# Altium project 2018_FDP.PrjPcb
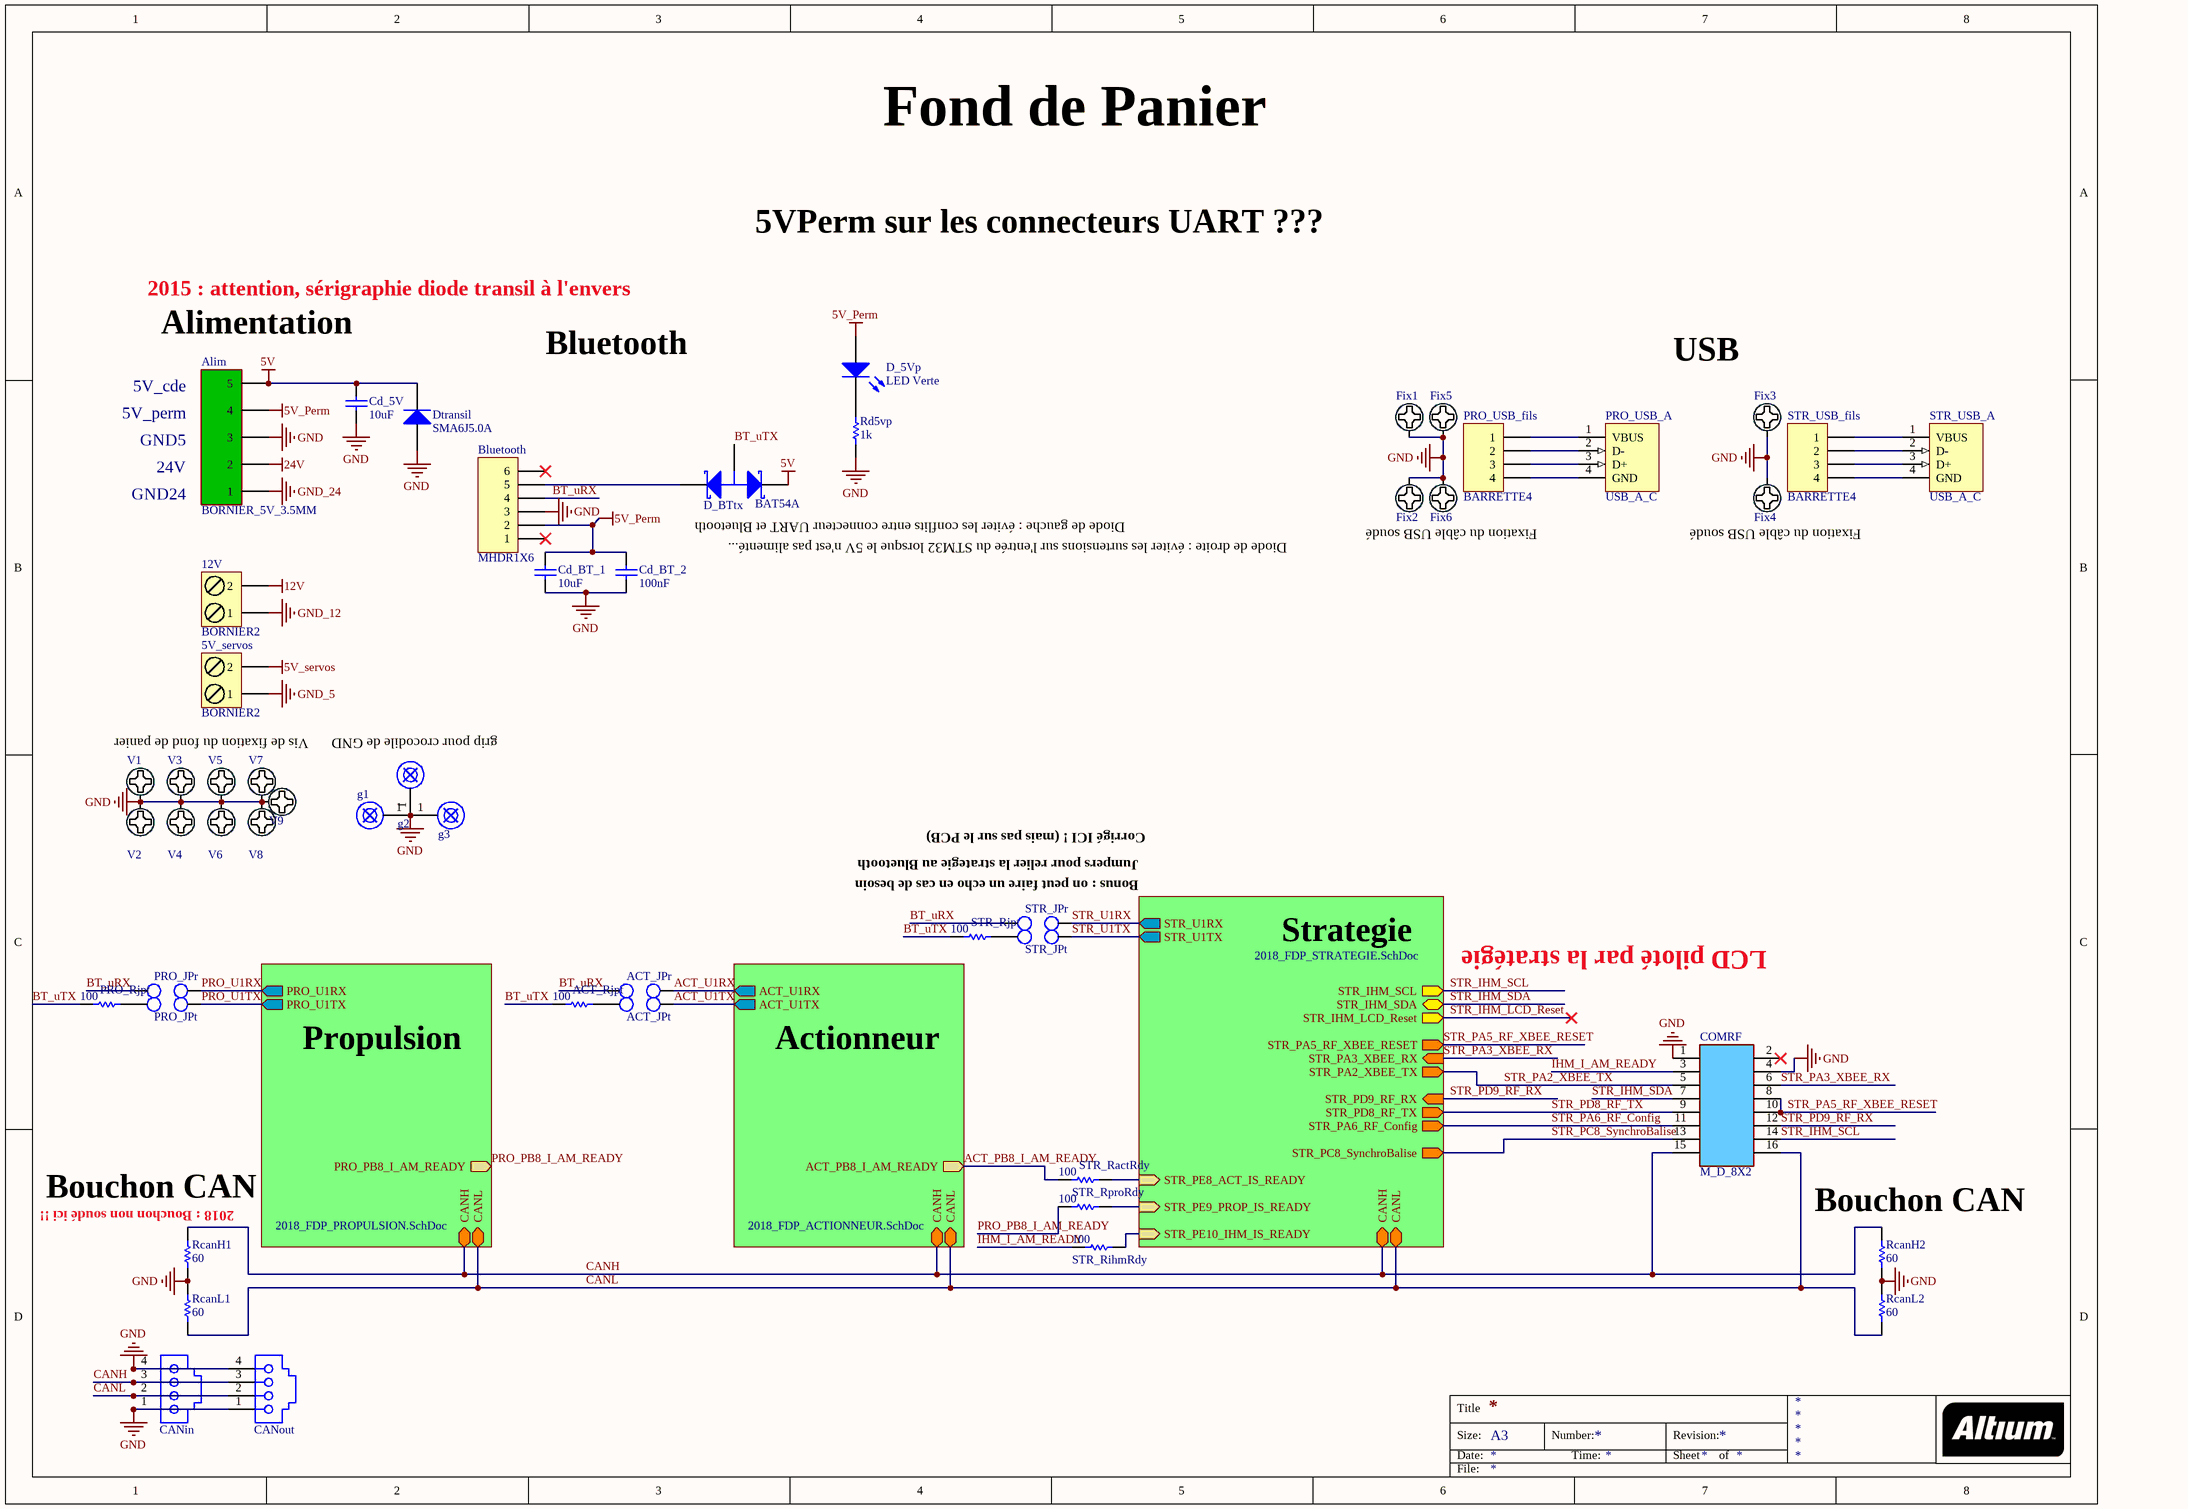
[diagram p0: 2018_FDP_SCHEMA.SchDoc]
3 sheets, 229 parts. Net scope: hierarchical (ports join the sheet entries above them; power ports are global).
Board file: 2018_FDP_PCB.PcbDoc
Sheets:
  2018_FDP_SCHEMA.SchDoc
    Propulsion = 2018_FDP_PROPULSION.SchDoc
    Actionneur = 2018_FDP_ACTIONNEUR.SchDoc

## Sheet 2018_FDP_SCHEMA.SchDoc
size A3

### Parts
5V_servos  BORNIER2  [BORNIER_2V_5.08MM]
12V  BORNIER2  [BORNIER_2V_5.08MM]
ACT_JPr  JUMPER2  [BARRETTE_2_M_D]  (value not drawn)
ACT_JPt  JUMPER2  [BARRETTE_2_M_D]  (value not drawn)
ACT_Rjpt  100  [R1206_N]
Alim  BORNIER_5V_3.5MM  [BORNIER_5V_3.5MM_femelle_0]
Bluetooth  MHDR1X6  [HE14_6]
CANin  634104149621  [634104149621]  (value not drawn)
CANout  634104149621  [634104149621]  (value not drawn)
Cd_5V  10uF  [C1206_N]
Cd_BT_1  10uF  [C1206_N]
Cd_BT_2  100nF  [C0805_N]
COMRF  Type: M_D_8X2  [HE10/16_M_D_B P]  (hidden comment: BARRETTE_8 CONTACTS_2 RANGEES_MALE_DROITE)
D_5Vp  LED Verte  [LED_0805]
D_BTtx  BAT54A  [SOT23-3N]
Dtransil  SMA6J5.0A  [DO214AC]
Fix1  Pad_M3  [Point Test_D3_P1.6mm]  (value not drawn)
Fix2  Pad_M3  [Point Test_D3_P1.6mm]  (value not drawn)
Fix3  Pad_M3  [Point Test_D3_P1.6mm]  (value not drawn)
Fix4  Pad_M3  [Point Test_D3_P1.6mm]  (value not drawn)
Fix5  Pad_M3  [Point Test_D3_P1.6mm]  (value not drawn)
Fix6  Pad_M3  [Point Test_D3_P1.6mm]  (value not drawn)
g1  grip  [POINT_TEST]  (value not drawn)
g2  grip  [POINT_TEST]  (value not drawn)
g3  grip  [POINT_TEST]  (value not drawn)
PRO_JPr  JUMPER2  [BARRETTE_2_M_D]  (value not drawn)
PRO_JPt  JUMPER2  [BARRETTE_2_M_D]  (value not drawn)
PRO_Rjpt  100  [R1206_N]
PRO_USB_A  USB_A_COUDEE  [USB_A_C]  (value not drawn)
PRO_USB_fils  BARRETTE4  [HE14_4]
RcanH1  60  [R1206_N]
RcanH2  60  [R1206_N]
RcanL1  60  [R1206_N]
RcanL2  60  [R1206_N]
Rd5vp  1k  [R1206_N]
STR_JPr  JUMPER2  [BARRETTE_2_M_D]  (value not drawn)
STR_JPt  JUMPER2  [BARRETTE_2_M_D]  (value not drawn)
STR_RactRdy  100  [R1206_N]
STR_RihmRdy  100  [R1206_N]
STR_Rjpt  100  [R1206_N]
STR_RproRdy  100  [R1206_N]
STR_USB_A  USB_A_COUDEE  [USB_A_C]  (value not drawn)
STR_USB_fils  BARRETTE4  [HE14_4]
V1  Pad_M3  [M3x6mm Torx]  (value not drawn)
V2  Pad_M3  [M3x6mm Torx]  (value not drawn)
V3  Pad_M3  [M3x6mm Torx]  (value not drawn)
V4  Pad_M3  [M3x6mm Torx]  (value not drawn)
V5  Pad_M3  [M3x6mm Torx]  (value not drawn)
V6  Pad_M3  [M3x6mm Torx]  (value not drawn)
V7  Pad_M3  [M3x6mm Torx]  (value not drawn)
V8  Pad_M3  [M3x6mm Torx]  (value not drawn)
V9  Pad_M3  [M3x6mm Torx]  (value not drawn)

### Sub-sheets
Actionneur = 2018_FDP_ACTIONNEUR.SchDoc: CANH (bidir), CANL (bidir), ACT_U1RX (out), ACT_U1TX (out), ACT_PB8_I_AM_READY (out)
Propulsion = 2018_FDP_PROPULSION.SchDoc: CANH (bidir), CANL (bidir), PRO_U1RX (out), PRO_U1TX (out), PRO_PB8_I_AM_READY (out)
Strategie = 2018_FDP_STRATEGIE.SchDoc (file not in this document): STR_IHM_SCL (out), STR_IHM_SDA (bidir), STR_IHM_LCD_Reset (out), STR_PA3_XBEE_RX (in), STR_PA2_XBEE_TX (out), STR_PA5_RF_XBEE_RESET (out), STR_PA6_RF_Config (out), STR_PC8_SynchroBalise (out), STR_PD8_RF_TX (out), STR_PD9_RF_RX (in), CANL (bidir), CANH (bidir), STR_U1RX (out), STR_U1TX (out), STR_PE9_PROP_IS_READY (in), STR_PE8_ACT_IS_READY (in), STR_PE10_IHM_IS_READY (in)

### Nets
5V: Alim.5 Cd_5V.2 D_BTtx.2(K2) Dtransil.2(K)
5V_Perm: Alim.4 Bluetooth.2 Cd_BT_1.2 Cd_BT_2.2 D_5Vp.1(A)
5V_servos: 5V_servos.2
12V: 12V.2
24V: Alim.2
GND: Alim.3 Bluetooth.3 CANin.1 CANin.4 CANout.1 CANout.4 Cd_5V.1 Cd_BT_1.1 Cd_BT_2.1 COMRF.1 COMRF.4 Dtransil.1(A) Fix1.1 Fix2.1 Fix3.1 Fix4.1 Fix5.1 Fix6.1 g1.1 g2.1 g3.1 RcanH1.1 RcanH2.2 RcanL1.2 RcanL2.2 Rd5vp.2 V1.1 V2.1 V3.1 V4.1 V5.1 V6.1 V7.1 V8.1 V9.1
GND_5: 5V_servos.1
GND_12: 12V.1
GND_24: Alim.1
ACT_PB8_I_AM_READY: STR_RactRdy.2 ; sheet Actionneur/ACT_PB8_I_AM_READY
ACT_U1RX: ACT_JPr.2 ; sheet Actionneur/ACT_U1RX
ACT_U1TX: ACT_JPt.2 ; sheet Actionneur/ACT_U1TX
BT_uRX: ACT_JPr.1 Bluetooth.4 PRO_JPr.1 STR_JPr.1
BT_uTX: ACT_Rjpt.2 D_BTtx.3(A) PRO_Rjpt.2 STR_Rjpt.2
CANH: CANin.3 CANout.3 COMRF.15 RcanH1.2 RcanH2.1 ; sheet Propulsion/CANH, sheet Strategie/CANH, sheet Actionneur/CANH
CANL: CANin.2 CANout.2 COMRF.16 RcanL1.1 RcanL2.1 ; sheet Propulsion/CANL, sheet Strategie/CANL, sheet Actionneur/CANL
IHM_I_AM_READY: COMRF.3 STR_RihmRdy.2
PRO_PB8_I_AM_READY: STR_RproRdy.2 ; sheet Propulsion/PRO_PB8_I_AM_READY
PRO_U1RX: PRO_JPr.2 ; sheet Propulsion/PRO_U1RX
PRO_U1TX: PRO_JPt.2 ; sheet Propulsion/PRO_U1TX
STR_IHM_LCD_Reset: sheet Strategie/STR_IHM_LCD_Reset
STR_IHM_SCL: COMRF.14 ; sheet Strategie/STR_IHM_SCL
STR_IHM_SDA: COMRF.7 ; sheet Strategie/STR_IHM_SDA
STR_PA2_XBEE_TX: COMRF.5 ; sheet Strategie/STR_PA2_XBEE_TX
STR_PA3_XBEE_RX: COMRF.6 ; sheet Strategie/STR_PA3_XBEE_RX
STR_PA5_RF_XBEE_RESET: COMRF.8 COMRF.10 ; sheet Strategie/STR_PA5_RF_XBEE_RESET
STR_PA6_RF_Config: COMRF.11 ; sheet Strategie/STR_PA6_RF_Config
STR_PC8_SynchroBalise: COMRF.13 ; sheet Strategie/STR_PC8_SynchroBalise
STR_PD8_RF_TX: COMRF.9 ; sheet Strategie/STR_PD8_RF_TX
STR_PD9_RF_RX: COMRF.12 ; sheet Strategie/STR_PD9_RF_RX
STR_U1RX: STR_JPr.2 ; sheet Strategie/STR_U1RX
STR_U1TX: STR_JPt.2 ; sheet Strategie/STR_U1TX
NetACT_JPt_1: ACT_JPt.1 ACT_Rjpt.1
NetBluetooth_5: Bluetooth.5 D_BTtx.1(K1)
NetD_5Vp_2: D_5Vp.2(K) Rd5vp.1
NetPRO_JPt_1: PRO_JPt.1 PRO_Rjpt.1
NetPRO_USB_A_1: PRO_USB_A.1(VBUS) PRO_USB_fils.1
NetPRO_USB_A_2: PRO_USB_A.2(D-) PRO_USB_fils.2
NetPRO_USB_A_3: PRO_USB_A.3(D+) PRO_USB_fils.3
NetPRO_USB_A_4: PRO_USB_A.4(GND) PRO_USB_fils.4
NetSTR_JPt_1: STR_JPt.1 STR_Rjpt.1
NetSTR_RactRdy_1: STR_RactRdy.1 ; sheet Strategie/STR_PE8_ACT_IS_READY
NetSTR_RihmRdy_1: STR_RihmRdy.1 ; sheet Strategie/STR_PE10_IHM_IS_READY
NetSTR_RproRdy_1: STR_RproRdy.1 ; sheet Strategie/STR_PE9_PROP_IS_READY
NetSTR_USB_A_1: STR_USB_A.1(VBUS) STR_USB_fils.1
NetSTR_USB_A_2: STR_USB_A.2(D-) STR_USB_fils.2
NetSTR_USB_A_3: STR_USB_A.3(D+) STR_USB_fils.3
NetSTR_USB_A_4: STR_USB_A.4(GND) STR_USB_fils.4

Not connected (* = marked no-connect by the designer): Bluetooth 1* 6*; COMRF 2*

### Notes on the sheet
- Fond de Panier
- 5VPerm sur les connecteurs UART ???
- 2015 : attention, sérigraphie diode transil à l'envers
- Alimentation
- Bluetooth
- USB
- 5V_perm
- 5V_cde
- GND5
- 24V
- GND24
- Diode de gauche : éviter les conflits entre connecteur UART et Bluetooth
- (near Cd_BT_2) Diode de droite : éviter les surtensions sur l'entrée du STM32 lorsque le 5V n'est pas alimenté...
- Fixation du câble USB soudé
- Vis de fixation du fond de panier
- (near g2) grip pour crocodile de GND
- Jumpers pour relier la strategie au Bluetooth
- Corrigé ICI ! (mais pas sur le PCB)
- Bonus : on peut faire un echo en cas de besoin
- LCD piloté par la stratégie
- (near RcanH1) Bouchon CAN
- (near RcanH1) 2018 : Bouchon non soudé ici !!
- (near RcanH2) Bouchon CAN
- Title
- Size:
- Date:
- A3
- Number:
- Time:
- Revision:
- Sheet
- of
- File:

### Library data of the parts
5V_servos 12V = BORNIER2: Terminal blocks, 2 pins, pitch=5mm
ACT_JPr ACT_JPt PRO_JPr PRO_JPt STR_JPr STR_JPt = JUMPER2: BARRETTE 2 CONTACTS 1 RANGEE MALE DROITE; Type: JUMPER2
ACT_Rjpt PRO_Rjpt RcanH1 RcanH2 RcanL1 RcanL2 Rd5vp STR_RactRdy STR_RihmRdy STR_Rjpt STR_RproRdy = Resistor: Published: 8-Jun-2000; LatestRevisionDate: 17-Jul-2002; LatestRevisionNote: Re-released for DXP Platform.; PackageReference: AXIAL-0.5; Publisher: Altium Limited
Bluetooth = MHDR1X6: Header, 6-Pin; LatestRevisionDate: 17-Jul-2002; LatestRevisionNote: Re-released for DXP Platform.; Publisher: Altium Limited
CANin CANout = 634104149621: Modular Jack SMT Vertical Plastic 4P4C Top Entry WR-MJ; Rated Current: 1.5 A; Working Voltage: 120 VAC; Withstanding Voltage: 1000 VAC; Port: 1x1; ComponentLink1Description: Manufacturer; ComponentLink1URL: http://www.we-online.de; ComponentLink2Description: Datasheet; ComponentLink2URL: http://katalog.we-online.com/em/datasheet/634104149621.pdf; Part Number: 634104149621; Published Date: September 2017; Publisher: Wurth Elektronik; Pin Number: 4P4C; Entrance: Vertical
Cd_5V Cd_BT_1 Cd_BT_2 = Condensateur: Capacitor; Published: 8-Jun-2000; LatestRevisionDate: 17-Jul-2002; LatestRevisionNote: Re-released for DXP Platform.; PackageReference: RAD-0.3; Publisher: Altium Limited
D_5Vp = LED: Typical LED; Published: 8-Jun-2000; LatestRevisionDate: 08-Jul-2005; LatestRevisionNote: Mech Layer 1 removed.; PackageReference: LED-1; Publisher: Altium Limited
D_BTtx = Diode Shottky double  BAT54A: DIODE SCHOTTKY DOUBLE; Manufacturer: ZETEX; ComponentLink1URL: http://www.farnell.com/datasheets/27632.pdf; ComponentLink1Description: http://www.farnell.com/datasheets/27632.pdf; Supplier Part Number: 9526498; Supplier: Farnell; RoHS: YES; Manufacturer Part Number: BAT54A
Dtransil = Diode 1N4001: 1 Amp General Purpose Rectifier; Published: 8-Jun-2000; LatestRevisionDate: 17-Jul-2002; LatestRevisionNote: Re-released for DXP Platform.; DatasheetVersion: 1998; PackageVersion: Aug-1999; PackageReference: DO-41; Publisher: Altium Limited; Code_JEDEC: DO-204-AL; ComponentLink1Description: Manufacturer Link; ComponentLink1URL: http://www.fairchildsemi.com/; ComponentLink2Description: Datasheet; ComponentLink2URL: http://www.fairchildsemi.com/ds/1N%2F1N4001.pdf
Fix1-Fix6 V1-V9 = Vis M3 X 6mm _TORX_Tête 6mm: Publisher: Damien Guitton
g1-g3 = POINT_TEST: POINT TEST
PRO_USB_A STR_USB_A = USB_A_COUDEE: EMBASE USB TRAVERSANTE TYPE A COUDEE; Type: USB_A_C
PRO_USB_fils STR_USB_fils = BARRETTE4: Header, 4-Pin; LatestRevisionDate: 17-Jul-2002; LatestRevisionNote: Re-released for DXP Platform.; Publisher: Altium Limited

## Sheet 2018_FDP_PROPULSION.SchDoc
size A2
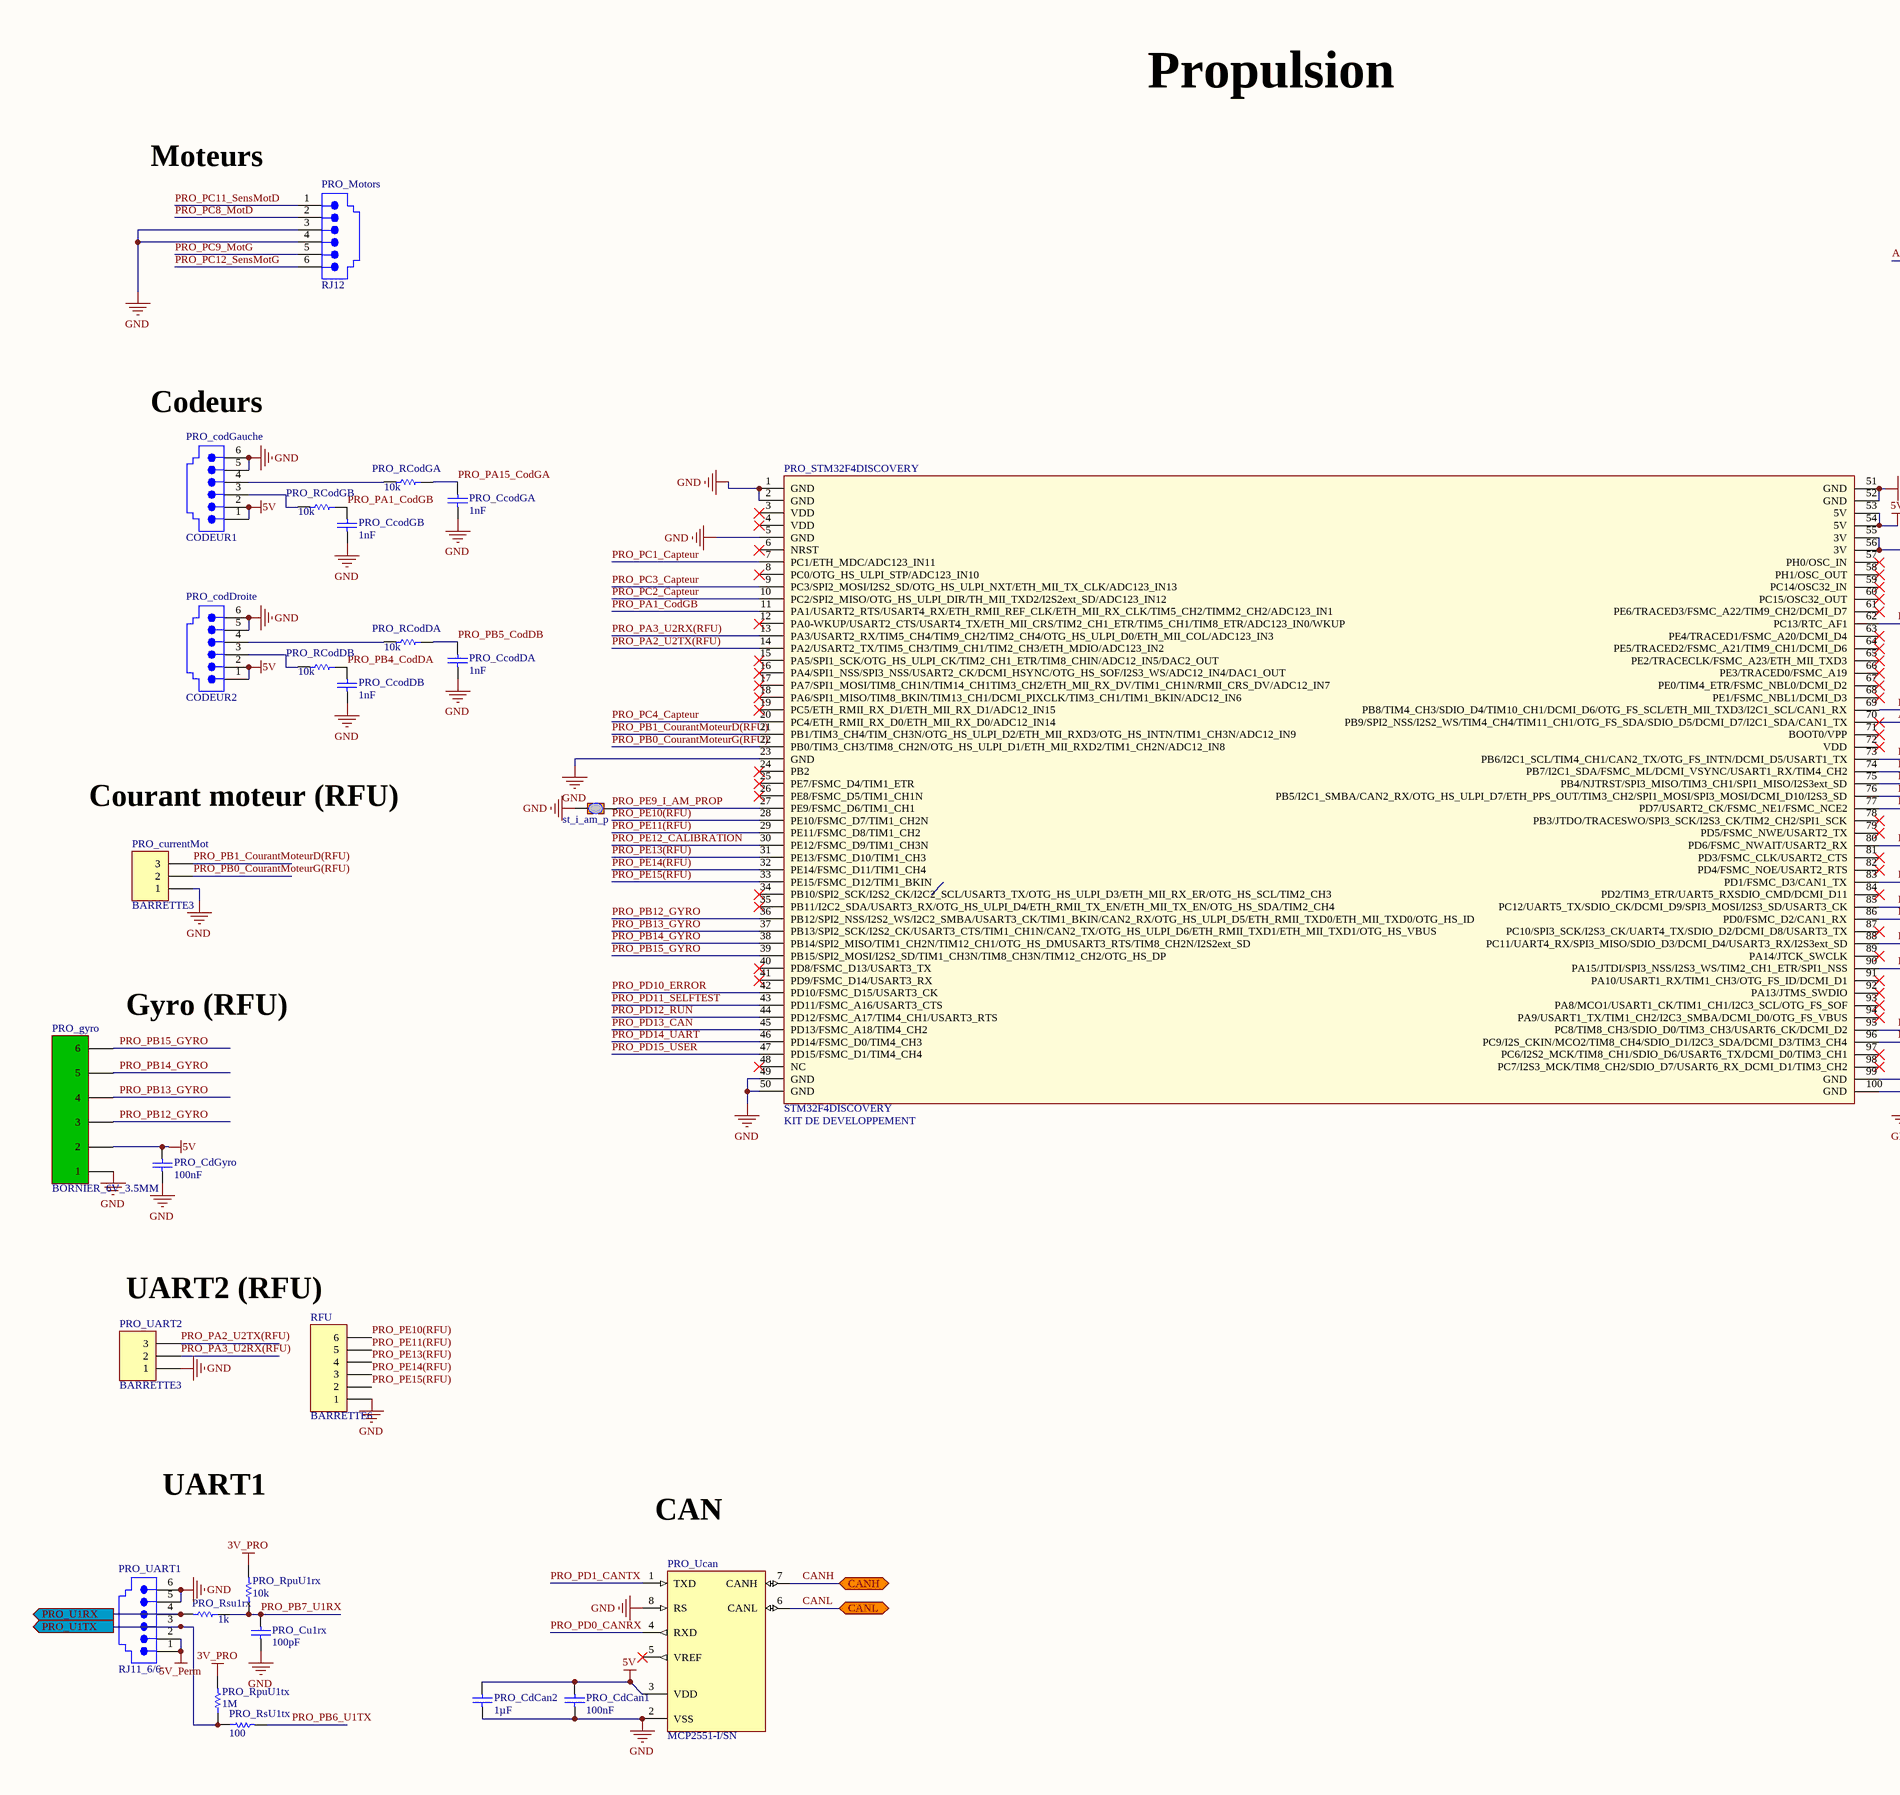
[diagram p1: 2018_FDP_PROPULSION.SchDoc, left]
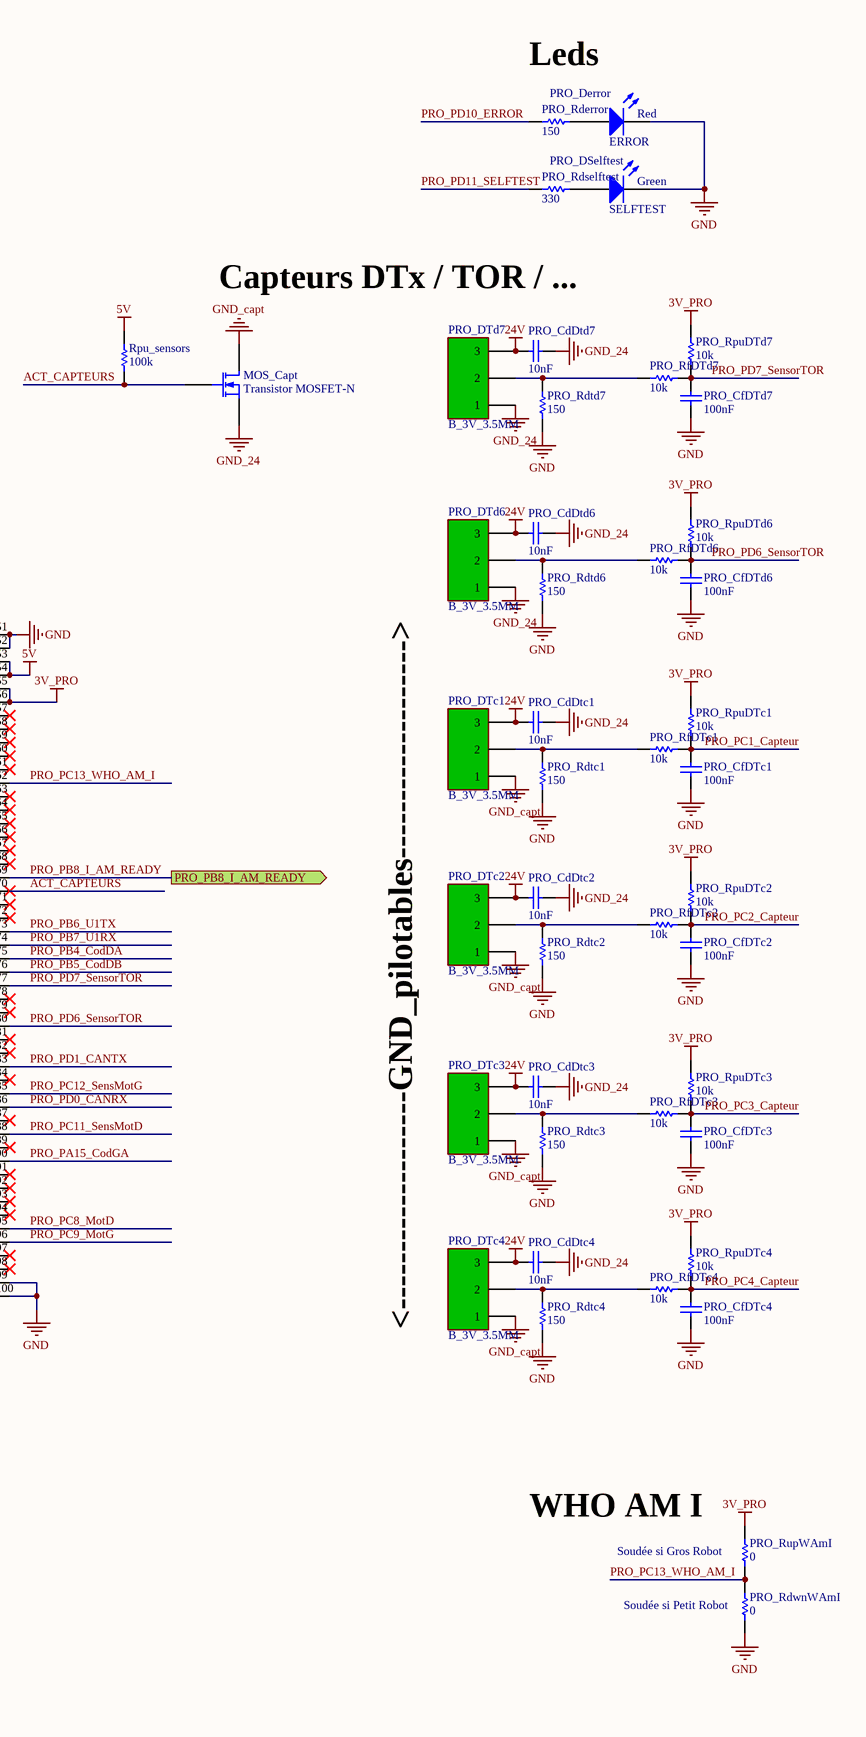
[diagram p2: 2018_FDP_PROPULSION.SchDoc, right]

### Parts
MOS_Capt  Transistor MOSFET-N  [SOT23-3N]
PRO_CcodDA  1nF  [C0805_N]
PRO_CcodDB  1nF  [C0805_N]
PRO_CcodGA  1nF  [C0805_N]
PRO_CcodGB  1nF  [C0805_N]
PRO_CdCan1  100nF  [C0805_N]
PRO_CdCan2  1µF  [C0805_N]
PRO_CdDtc1  10nF  [C0805_N]
PRO_CdDtc2  10nF  [C0805_N]
PRO_CdDtc3  10nF  [C0805_N]
PRO_CdDtc4  10nF  [C0805_N]
PRO_CdDtd6  10nF  [C0805_N]
PRO_CdDtd7  10nF  [C0805_N]
PRO_CdGyro  100nF  [C0805_N]
PRO_CfDTc1  100nF  [C0805_N]
PRO_CfDTc2  100nF  [C0805_N]
PRO_CfDTc3  100nF  [C0805_N]
PRO_CfDTc4  100nF  [C0805_N]
PRO_CfDTd6  100nF  [C0805_N]
PRO_CfDTd7  100nF  [C0805_N]
PRO_codDroite  CODEUR2  [RJ11_6/6 - droit]
PRO_codGauche  CODEUR1  [RJ11_6/6 - droit]
PRO_Cu1rx  100pF  [C0805_N]
PRO_currentMot  BARRETTE3  [HE14_3]
PRO_Derror  ERROR  [LED_0805]
PRO_DSelftest  SELFTEST  [LED_0805]
PRO_DTc1  B_3V_3.5MM  [BORNIER_3V_3.5MM]
PRO_DTc2  B_3V_3.5MM  [BORNIER_3V_3.5MM]
PRO_DTc3  B_3V_3.5MM  [BORNIER_3V_3.5MM]
PRO_DTc4  B_3V_3.5MM  [BORNIER_3V_3.5MM]
PRO_DTd6  B_3V_3.5MM  [BORNIER_3V_3.5MM]
PRO_DTd7  B_3V_3.5MM  [BORNIER_3V_3.5MM]
PRO_gyro  BORNIER_6V_3.5MM  [BORNIER_6V_3.5MM]
PRO_Motors  RJ12  [RJ11_6/6 - droit]
PRO_RCodDA  10k  [R1206_N]
PRO_RCodDB  10k  [R1206_N]
PRO_RCodGA  10k  [R1206_N]
PRO_RCodGB  10k  [R1206_N]
PRO_Rderror  150  [R1206_N]
PRO_Rdselftest  330  [R1206_N]
PRO_Rdtc1  150  [R1206_N]
PRO_Rdtc2  150  [R1206_N]
PRO_Rdtc3  150  [R1206_N]
PRO_Rdtc4  150  [R1206_N]
PRO_Rdtd6  150  [R1206_N]
PRO_Rdtd7  150  [R1206_N]
PRO_RdwnWAmI  0  [R1206_N]
PRO_RfDTc1  10k  [R1206_N]
PRO_RfDTc2  10k  [R1206_N]
PRO_RfDTc3  10k  [R1206_N]
PRO_RfDTc4  10k  [R1206_N]
PRO_RfDTd6  10k  [R1206_N]
PRO_RfDTd7  10k  [R1206_N]
PRO_RpuDTc1  10k  [R1206_N]
PRO_RpuDTc2  10k  [R1206_N]
PRO_RpuDTc3  10k  [R1206_N]
PRO_RpuDTc4  10k  [R1206_N]
PRO_RpuDTd6  10k  [R1206_N]
PRO_RpuDTd7  10k  [R1206_N]
PRO_RpuU1rx  10k  [R1206_N]
PRO_RpuU1tx  1M  [R1206_N]
PRO_Rsu1rx  1k  [R1206_N]
PRO_RsU1tx  100  [R1206_N]
PRO_RupWAmI  0  [R1206_N]
PRO_STM32F4DISCOVERY  STM32F4DISCOVERY  Type: KIT DE DEVELOPPEMENT  [STM32_F4DISCOVERY]
PRO_UART1  RJ11_6/6  [RJ11_6/6 - droit]
PRO_UART2  BARRETTE3  [HE14_3]
PRO_Ucan  MCP2551-I/SN  [SO8_N]
RFU  BARRETTE6  [HE14_6]
Rpu_sensors  100k  [R1206_N]
st_i_am_p  Goutte Strap_2  [Goutte Strap_2 Pads_Clearance 0.254mm]  (value not drawn)

### Ports
CANH (bidir), CANL (bidir), PRO_PB8_I_AM_READY (out), PRO_U1RX (out), PRO_U1TX (out)

### Nets
3V_PRO: PRO_RpuDTc1.2 PRO_RpuDTc2.2 PRO_RpuDTc3.2 PRO_RpuDTc4.2 PRO_RpuDTd6.2 PRO_RpuDTd7.2 PRO_RpuU1rx.2 PRO_RpuU1tx.2 PRO_RupWAmI.2 PRO_STM32F4DISCOVERY.55(3V) PRO_STM32F4DISCOVERY.56(3V)
5V: PRO_CdCan1.2 PRO_CdCan2.2 PRO_CdGyro.2 PRO_codDroite.1 PRO_codDroite.2 PRO_codGauche.1 PRO_codGauche.2 PRO_gyro.2 PRO_STM32F4DISCOVERY.53(5V) PRO_STM32F4DISCOVERY.54(5V) PRO_Ucan.3(VDD) Rpu_sensors.2
5V_Perm: PRO_UART1.1 PRO_UART1.2
24V: PRO_CdDtc1.2 PRO_CdDtc2.2 PRO_CdDtc3.2 PRO_CdDtc4.2 PRO_CdDtd6.2 PRO_CdDtd7.2 PRO_DTc1.3 PRO_DTc2.3 PRO_DTc3.3 PRO_DTc4.3 PRO_DTd6.3 PRO_DTd7.3
GND: PRO_CcodDA.1 PRO_CcodDB.1 PRO_CcodGA.1 PRO_CcodGB.1 PRO_CdCan1.1 PRO_CdCan2.1 PRO_CdGyro.1 PRO_CfDTc1.1 PRO_CfDTc2.1 PRO_CfDTc3.1 PRO_CfDTc4.1 PRO_CfDTd6.1 PRO_CfDTd7.1 PRO_codDroite.5 PRO_codDroite.6 PRO_codGauche.5 PRO_codGauche.6 PRO_Cu1rx.1 PRO_currentMot.1 PRO_Derror.2(K) PRO_DSelftest.2(K) PRO_gyro.1 PRO_Motors.3 PRO_Motors.4 PRO_Rdtc1.1 PRO_Rdtc2.1 PRO_Rdtc3.1 PRO_Rdtc4.1 PRO_Rdtd6.1 PRO_Rdtd7.1 PRO_RdwnWAmI.1 PRO_STM32F4DISCOVERY.1(GND) PRO_STM32F4DISCOVERY.2(GND) PRO_STM32F4DISCOVERY.5(GND) PRO_STM32F4DISCOVERY.23(GND) PRO_STM32F4DISCOVERY.49(GND) PRO_STM32F4DISCOVERY.50(GND) PRO_STM32F4DISCOVERY.51(GND) PRO_STM32F4DISCOVERY.52(GND) PRO_STM32F4DISCOVERY.99(GND) PRO_STM32F4DISCOVERY.100(GND) PRO_UART1.5 PRO_UART1.6 PRO_UART2.1 PRO_Ucan.2(VSS) PRO_Ucan.8(RS) RFU.1 st_i_am_p.1
GND_24: MOS_Capt.2(S) PRO_CdDtc1.1 PRO_CdDtc2.1 PRO_CdDtc3.1 PRO_CdDtc4.1 PRO_CdDtd6.1 PRO_CdDtd7.1 PRO_DTd6.1 PRO_DTd7.1
GND_capt: MOS_Capt.3(D) PRO_DTc1.1 PRO_DTc2.1 PRO_DTc3.1 PRO_DTc4.1
ACT_CAPTEURS: MOS_Capt.1(G) PRO_STM32F4DISCOVERY.70(PB9/SPI2_NSS/I2S2_WS/TIM4_CH4/TIM11_CH1/OTG_FS_SDA/SDIO_D5/DCMI_D7/I2C1_SDA/CAN1_TX) Rpu_sensors.1
CANH: PRO_Ucan.7(CANH) ; port CANH
CANL: PRO_Ucan.6(CANL) ; port CANL
PRO_PA1_CodGB: PRO_CcodGB.2 PRO_RCodGB.1 PRO_STM32F4DISCOVERY.11(PA1/USART2_RTS/USART4_RX/ETH_RMII_REF_CLK/ETH_MII_RX_CLK/TIM5_CH2/TIMM2_CH2/ADC123_IN1)
PRO_PA2_U2TX(RFU): PRO_STM32F4DISCOVERY.14(PA2/USART2_TX/TIM5_CH3/TIM9_CH1/TIM2_CH3/ETH_MDIO/ADC123_IN2) PRO_UART2.3
PRO_PA3_U2RX(RFU): PRO_STM32F4DISCOVERY.13(PA3/USART2_RX/TIM5_CH4/TIM9_CH2/TIM2_CH4/OTG_HS_ULPI_D0/ETH_MII_COL/ADC123_IN3) PRO_UART2.2
PRO_PA15_CodGA: PRO_CcodGA.2 PRO_RCodGA.1 PRO_STM32F4DISCOVERY.90(PA15/JTDI/SPI3_NSS/I2S3_WS/TIM2_CH1_ETR/SPI1_NSS)
PRO_PB0_CourantMoteurG(RFU): PRO_currentMot.2 PRO_STM32F4DISCOVERY.22(PB0/TIM3_CH3/TIM8_CH2N/OTG_HS_ULPI_D1/ETH_MII_RXD2/TIM1_CH2N/ADC12_IN8)
PRO_PB1_CourantMoteurD(RFU): PRO_currentMot.3 PRO_STM32F4DISCOVERY.21(PB1/TIM3_CH4/TIM_CH3N/OTG_HS_ULPI_D2/ETH_MII_RXD3/OTG_HS_INTN/TIM1_CH3N/ADC12_IN9)
PRO_PB4_CodDA: PRO_CcodDB.2 PRO_RCodDB.1 PRO_STM32F4DISCOVERY.75(PB4/NJTRST/SPI3_MISO/TIM3_CH1/SPI1_MISO/I2S3ext_SD)
PRO_PB5_CodDB: PRO_CcodDA.2 PRO_RCodDA.1 PRO_STM32F4DISCOVERY.76(PB5/I2C1_SMBA/CAN2_RX/OTG_HS_ULPI_D7/ETH_PPS_OUT/TIM3_CH2/SPI1_MOSI/SPI3_MOSI/DCMI_D10/I2S3_SD)
PRO_PB6_U1TX: PRO_RsU1tx.2 PRO_STM32F4DISCOVERY.73(PB6/I2C1_SCL/TIM4_CH1/CAN2_TX/OTG_FS_INTN/DCMI_D5/USART1_TX)
PRO_PB7_U1RX: PRO_Cu1rx.2 PRO_RpuU1rx.1 PRO_Rsu1rx.1 PRO_STM32F4DISCOVERY.74(PB7/I2C1_SDA/FSMC_ML/DCMI_VSYNC/USART1_RX/TIM4_CH2)
PRO_PB8_I_AM_READY: PRO_STM32F4DISCOVERY.69(PB8/TIM4_CH3/SDIO_D4/TIM10_CH1/DCMI_D6/OTG_FS_SCL/ETH_MII_TXD3/I2C1_SCL/CAN1_RX) ; port PRO_PB8_I_AM_READY
PRO_PB12_GYRO: PRO_gyro.3 PRO_STM32F4DISCOVERY.36(PB12/SPI2_NSS/I2S2_WS/I2C2_SMBA/USART3_CK/TIM1_BKIN/CAN2_RX/OTG_HS_ULPI_D5/ETH_RMII_TXD0/ETH_MII_TXD0/OTG_HS_ID)
PRO_PB13_GYRO: PRO_gyro.4 PRO_STM32F4DISCOVERY.37(PB13/SPI2_SCK/I2S2_CK/USART3_CTS/TIM1_CH1N/CAN2_TX/OTG_HS_ULPI_D6/ETH_RMII_TXD1/ETH_MII_TXD1/OTG_HS_VBUS)
PRO_PB14_GYRO: PRO_gyro.5 PRO_STM32F4DISCOVERY.38(PB14/SPI2_MISO/TIM1_CH2N/TIM12_CH1/OTG_HS_DMUSART3_RTS/TIM8_CH2N/I2S2ext_SD)
PRO_PB15_GYRO: PRO_gyro.6 PRO_STM32F4DISCOVERY.39(PB15/SPI2_MOSI/I2S2_SD/TIM1_CH3N/TIM8_CH3N/TIM12_CH2/OTG_HS_DP)
PRO_PC1_Capteur: PRO_CfDTc1.2 PRO_RfDTc1.2 PRO_RpuDTc1.1 PRO_STM32F4DISCOVERY.7(PC1/ETH_MDC/ADC123_IN11)
PRO_PC2_Capteur: PRO_CfDTc2.2 PRO_RfDTc2.2 PRO_RpuDTc2.1 PRO_STM32F4DISCOVERY.10(PC2/SPI2_MISO/OTG_HS_ULPI_DIR/TH_MII_TXD2/I2S2ext_SD/ADC123_IN12)
PRO_PC3_Capteur: PRO_CfDTc3.2 PRO_RfDTc3.2 PRO_RpuDTc3.1 PRO_STM32F4DISCOVERY.9(PC3/SPI2_MOSI/I2S2_SD/OTG_HS_ULPI_NXT/ETH_MII_TX_CLK/ADC123_IN13)
PRO_PC4_Capteur: PRO_CfDTc4.2 PRO_RfDTc4.2 PRO_RpuDTc4.1 PRO_STM32F4DISCOVERY.20(PC4/ETH_RMII_RX_D0/ETH_MII_RX_D0/ADC12_IN14)
PRO_PC8_MotD: PRO_Motors.2 PRO_STM32F4DISCOVERY.95(PC8/TIM8_CH3/SDIO_D0/TIM3_CH3/USART6_CK/DCMI_D2)
PRO_PC9_MotG: PRO_Motors.5 PRO_STM32F4DISCOVERY.96(PC9/I2S_CKIN/MCO2/TIM8_CH4/SDIO_D1/I2C3_SDA/DCMI_D3/TIM3_CH4)
PRO_PC11_SensMotD: PRO_Motors.1 PRO_STM32F4DISCOVERY.88(PC11/UART4_RX/SPI3_MISO/SDIO_D3/DCMI_D4/USART3_RX/I2S3ext_SD)
PRO_PC12_SensMotG: PRO_Motors.6 PRO_STM32F4DISCOVERY.85(PC12/UART5_TX/SDIO_CK/DCMI_D9/SPI3_MOSI/I2S3_SD/USART3_CK)
PRO_PC13_WHO_AM_I: PRO_RdwnWAmI.2 PRO_RupWAmI.1 PRO_STM32F4DISCOVERY.62(PC13/RTC_AF1)
PRO_PD0_CANRX: PRO_STM32F4DISCOVERY.86(PD0/FSMC_D2/CAN1_RX) PRO_Ucan.4(RXD)
PRO_PD1_CANTX: PRO_STM32F4DISCOVERY.83(PD1/FSMC_D3/CAN1_TX) PRO_Ucan.1(TXD)
PRO_PD6_SensorTOR: PRO_CfDTd6.2 PRO_RfDTd6.2 PRO_RpuDTd6.1 PRO_STM32F4DISCOVERY.80(PD6/FSMC_NWAIT/USART2_RX)
PRO_PD7_SensorTOR: PRO_CfDTd7.2 PRO_RfDTd7.2 PRO_RpuDTd7.1 PRO_STM32F4DISCOVERY.77(PD7/USART2_CK/FSMC_NE1/FSMC_NCE2)
PRO_PD10_ERROR: PRO_Rderror.1 PRO_STM32F4DISCOVERY.42(PD10/FSMC_D15/USART3_CK)
PRO_PD11_SELFTEST: PRO_Rdselftest.1 PRO_STM32F4DISCOVERY.43(PD11/FSMC_A16/USART3_CTS)
PRO_PD12_RUN: PRO_STM32F4DISCOVERY.44(PD12/FSMC_A17/TIM4_CH1/USART3_RTS)
PRO_PD13_CAN: PRO_STM32F4DISCOVERY.45(PD13/FSMC_A18/TIM4_CH2)
PRO_PD14_UART: PRO_STM32F4DISCOVERY.46(PD14/FSMC_D0/TIM4_CH3)
PRO_PD15_USER: PRO_STM32F4DISCOVERY.47(PD15/FSMC_D1/TIM4_CH4)
PRO_PE10(RFU): PRO_STM32F4DISCOVERY.28(PE10/FSMC_D7/TIM1_CH2N) RFU.6
PRO_PE11(RFU): PRO_STM32F4DISCOVERY.29(PE11/FSMC_D8/TIM1_CH2) RFU.5
PRO_PE12_CALIBRATION: PRO_STM32F4DISCOVERY.30(PE12/FSMC_D9/TIM1_CH3N)
PRO_PE13(RFU): PRO_STM32F4DISCOVERY.31(PE13/FSMC_D10/TIM1_CH3) RFU.4
PRO_PE14(RFU): PRO_STM32F4DISCOVERY.32(PE14/FSMC_D11/TIM1_CH4) RFU.3
PRO_PE15(RFU): PRO_STM32F4DISCOVERY.33(PE15/FSMC_D12/TIM1_BKIN) RFU.2
PRO_U1RX: PRO_Rsu1rx.2 PRO_UART1.4 ; port PRO_U1RX
PRO_U1TX: PRO_RpuU1tx.1 PRO_RsU1tx.1 PRO_UART1.3 ; port PRO_U1TX
NetPRO_codDroite_3: PRO_codDroite.3 PRO_RCodDB.2
NetPRO_codDroite_4: PRO_codDroite.4 PRO_RCodDA.2
NetPRO_codGauche_3: PRO_codGauche.3 PRO_RCodGB.2
NetPRO_codGauche_4: PRO_codGauche.4 PRO_RCodGA.2
NetPRO_Derror_1: PRO_Derror.1(A) PRO_Rderror.2
NetPRO_DSelftest_1: PRO_DSelftest.1(A) PRO_Rdselftest.2
NetPRO_DTc1_2: PRO_DTc1.2 PRO_Rdtc1.2 PRO_RfDTc1.1
NetPRO_DTc2_2: PRO_DTc2.2 PRO_Rdtc2.2 PRO_RfDTc2.1
NetPRO_DTc3_2: PRO_DTc3.2 PRO_Rdtc3.2 PRO_RfDTc3.1
NetPRO_DTc4_2: PRO_DTc4.2 PRO_Rdtc4.2 PRO_RfDTc4.1
NetPRO_DTd6_2: PRO_DTd6.2 PRO_Rdtd6.2 PRO_RfDTd6.1
NetPRO_DTd7_2: PRO_DTd7.2 PRO_Rdtd7.2 PRO_RfDTd7.1
NetPRO_STM32F4DISCOVERY_27: PRO_STM32F4DISCOVERY.27(PE9/FSMC_D6/TIM1_CH1) st_i_am_p.2

Not connected (* = marked no-connect by the designer): PRO_STM32F4DISCOVERY 3(VDD)* 4(VDD)* 6(NRST)* 8(PC0/OTG_HS_ULPI_STP/ADC123_IN10)* 12(PA0-WKUP/USART2_CTS/USART4_TX/ETH_MII_CRS/TIM2_CH1_ETR/TIM5_CH1/TIM8_ETR/ADC123_IN0/WKUP)* 15(PA5/SPI1_SCK/OTG_HS_ULPI_CK/TIM2_CH1_ETR/TIM8_CHIN/ADC12_IN5/DAC2_OUT)* 16(PA4/SPI1_NSS/SPI3_NSS/USART2_CK/DCMI_HSYNC/OTG_HS_SOF/I2S3_WS/ADC12_IN4/DAC1_OUT)* 17(PA7/SPI1_MOSI/TIM8_CH1N/TIM14_CH1TIM3_CH2/ETH_MII_RX_DV/TIM1_CH1N/RMII_CRS_DV/ADC12_IN7)* 18(PA6/SPI1_MISO/TIM8_BKIN/TIM13_CH1/DCMI_PIXCLK/TIM3_CH1/TIM1_BKIN/ADC12_IN6)* 19(PC5/ETH_RMII_RX_D1/ETH_MII_RX_D1/ADC12_IN15)* 24(PB2)* 25(PE7/FSMC_D4/TIM1_ETR)* 26(PE8/FSMC_D5/TIM1_CH1N)* 34(PB10/SPI2_SCK/I2S2_CK/I2C2_SCL/USART3_TX/OTG_HS_ULPI_D3/ETH_MII_RX_ER/OTG_HS_SCL/TIM2_CH3)* 35(PB11/I2C2_SDA/USART3_RX/OTG_HS_ULPI_D4/ETH_RMII_TX_EN/ETH_MII_TX_EN/OTG_HS_SDA/TIM2_CH4)* 40(PD8/FSMC_D13/USART3_TX)* 41(PD9/FSMC_D14/USART3_RX)* 48(NC)* 57(PH0/OSC_IN)* 58(PH1/OSC_OUT)* 59(PC14/OSC32_IN)* 60(PC15/OSC32_OUT)* 61(PE6/TRACED3/FSMC_A22/TIM9_CH2/DCMI_D7)* 63(PE4/TRACED1/FSMC_A20/DCMI_D4)* 64(PE5/TRACED2/FSMC_A21/TIM9_CH1/DCMI_D6)* 65(PE2/TRACECLK/FSMC_A23/ETH_MII_TXD3)* 66(PE3/TRACED0/FSMC_A19)* 67(PE0/TIM4_ETR/FSMC_NBL0/DCMI_D2)* 68(PE1/FSMC_NBL1/DCMI_D3)* 71(BOOT0/VPP)* 72(VDD)* 78(PB3/JTDO/TRACESWO/SPI3_SCK/I2S3_CK/TIM2_CH2/SPI1_SCK)* 79(PD5/FSMC_NWE/USART2_TX)* 81(PD3/FSMC_CLK/USART2_CTS)* 82(PD4/FSMC_NOE/USART2_RTS)* 84(PD2/TIM3_ETR/UART5_RXSDIO_CMD/DCMI_D11)* 87(PC10/SPI3_SCK/I2S3_CK/UART4_TX/SDIO_D2/DCMI_D8/USART3_TX)* 89(PA14/JTCK_SWCLK)* 91(PA10/USART1_RX/TIM1_CH3/OTG_FS_ID/DCMI_D1)* 92(PA13/JTMS_SWDIO)* 93(PA8/MCO1/USART1_CK/TIM1_CH1/I2C3_SCL/OTG_FS_SOF)* 94(PA9/USART1_TX/TIM1_CH2/I2C3_SMBA/DCMI_D0/OTG_FS_VBUS)* 97(PC6/I2S2_MCK/TIM8_CH1/SDIO_D6/USART6_TX/DCMI_D0/TIM3_CH1)* 98(PC7/I2S3_MCK/TIM8_CH2/SDIO_D7/USART6_RX_DCMI_D1/TIM3_CH2)*; PRO_Ucan 5(VREF)*

### Notes on the sheet
- Leds
- (near PRO_Derror) Red
- Propulsion
- (near PRO_DSelftest) Green
- Moteurs
- Capteurs DTx / TOR / ...
- (near PRO_codGauche) Codeurs
- Courant moteur (RFU)
- (near PRO_gyro) Gyro (RFU)
- <-------------------GND_pilotables------------------->
- (near PRO_UART2) UART2 (RFU)
- WHO AM I
- (near PRO_RupWAmI) Soudée si Gros Robot
- (near PRO_RdwnWAmI) Soudée si Petit Robot
- UART1
- CAN
- Labels drawn without touching a wire or pin: PRO_PE9_I_AM_PROP
- Title
- Size:
- Date:
- File:
- A2
- Number:
- Time:
- Revision:
- Sheet
- of

### Library data of the parts
MOS_Capt = Transistor MOSFET-N: N-Channel MOSFET; PackageDocument: 1995/1996; Published: 8-Jun-2000; LatestRevisionDate: 17-Jul-2002; LatestRevisionNote: Re-released for DXP Platform.; PackageReference: E3; Publisher: Altium Limited
PRO_CcodDA PRO_CcodDB PRO_CcodGA PRO_CcodGB PRO_CdCan1 PRO_CdCan2 PRO_CdDtc1-PRO_CdDtc4 PRO_CdDtd6 PRO_CdDtd7 PRO_CdGyro PRO_CfDTc1-PRO_CfDTc4 PRO_CfDTd6 PRO_CfDTd7 PRO_Cu1rx = Condensateur: Capacitor; Published: 8-Jun-2000; LatestRevisionDate: 17-Jul-2002; LatestRevisionNote: Re-released for DXP Platform.; PackageReference: RAD-0.3; Publisher: Altium Limited
PRO_codDroite PRO_codGauche PRO_Motors PRO_UART1 = RJ11_6/6: Right Angle, Standard Profile, Offset Latch DECconnect, Flangeless PCB Jack; Ports: 1; Positions/Loaded: Port1 - 6 Offset Latch/6; PerformanceCategory: 3; PCB_Mounting: Thru-Hole; DrillSize: Nominal, Rounded to nearest 0.05mm; PCB_Layout: Complies with Manufacturer's Recommendation.; Published: 25-Jun-2002; DatasheetDocument: 18-Dec-2001; PackageDocument: 18-Dec-2001; PackageReference: 15-43-6110; Publisher: Altium Limited; ComponentLink1Description: Manufacturer Link; ComponentLink1URL: http://www.molex.com/; ComponentLink2Description: Datasheet; ComponentLink2URL: http://www.molex.com/cmc_upload/common_files/1212003_41369catalogpage.pdf
  PRO_Motors PRO_UART1: Type: RJ11_6/6
PRO_currentMot PRO_UART2 = BARRETTE3: Header, 3-Pin; LatestRevisionDate: 17-Jul-2002; LatestRevisionNote: Re-released for DXP Platform.; Publisher: Altium Limited
PRO_Derror PRO_DSelftest = LED: Typical LED; Published: 8-Jun-2000; LatestRevisionDate: 08-Jul-2005; LatestRevisionNote: Mech Layer 1 removed.; PackageReference: LED-1; Publisher: Altium Limited
PRO_DTc1-PRO_DTc4 PRO_DTd6 PRO_DTd7 = BORNIER_3V_3.5MM
PRO_RCodDA PRO_RCodDB PRO_RCodGA PRO_RCodGB PRO_Rderror PRO_Rdselftest PRO_Rdtc1-PRO_Rdtc4 PRO_Rdtd6 PRO_Rdtd7 PRO_RdwnWAmI PRO_RfDTc1-PRO_RfDTc4 PRO_RfDTd6 PRO_RfDTd7 PRO_RpuDTc1-PRO_RpuDTc4 PRO_RpuDTd6 PRO_RpuDTd7 PRO_RpuU1rx PRO_RpuU1tx PRO_Rsu1rx PRO_RsU1tx PRO_RupWAmI Rpu_sensors = Resistor: Published: 8-Jun-2000; LatestRevisionDate: 17-Jul-2002; LatestRevisionNote: Re-released for DXP Platform.; PackageReference: AXIAL-0.5; Publisher: Altium Limited
PRO_STM32F4DISCOVERY = STM32F4DISCOVERY: KIT DE DEVELOPPEMENT POUR MICROCONTROLEUR STM32F407VGT6
PRO_Ucan = MCP2551-I/SN: High-Speed CAN Transceiver, 8-Pin SOIC, Industrial Temperature; Published: 25/11/09; DatasheetVersion: revE, Jan-2007; PackageVersion: revAW, Oct-2008; PackageReference: SOIC-SN8; Publisher: Damien Guitton; PackageDescription: 8-Lead Plastic Small Outline (SN) - Narrow, 3.90mm Body [SOIC]; Code_JEDEC: MS-012; Code_IPC: SOIC127P600-8; ComponentLink1Description: Manufacturer Link; ComponentLink1URL: http://www.microchip.com; ComponentLink2Description: Datasheet; ComponentLink2URL: http://ww1.microchip.com/downloads/en/DeviceDoc/21667E.pdf; ComponentLink3Description: Packaging Specification; ComponentLink3URL: http://ww1.microchip.com/downloads/en/PackagingSpec/00049AW.pdf
RFU = BARRETTE6: Header, 6-Pin; LatestRevisionDate: 17-Jul-2002; LatestRevisionNote: Re-released for DXP Platform.; Publisher: Altium Limited
st_i_am_p = Goutte Strap_2: LatestRevisionDate: 30/01/11; Publisher: Damien Guitton

## Sheet 2018_FDP_ACTIONNEUR.SchDoc
size A2
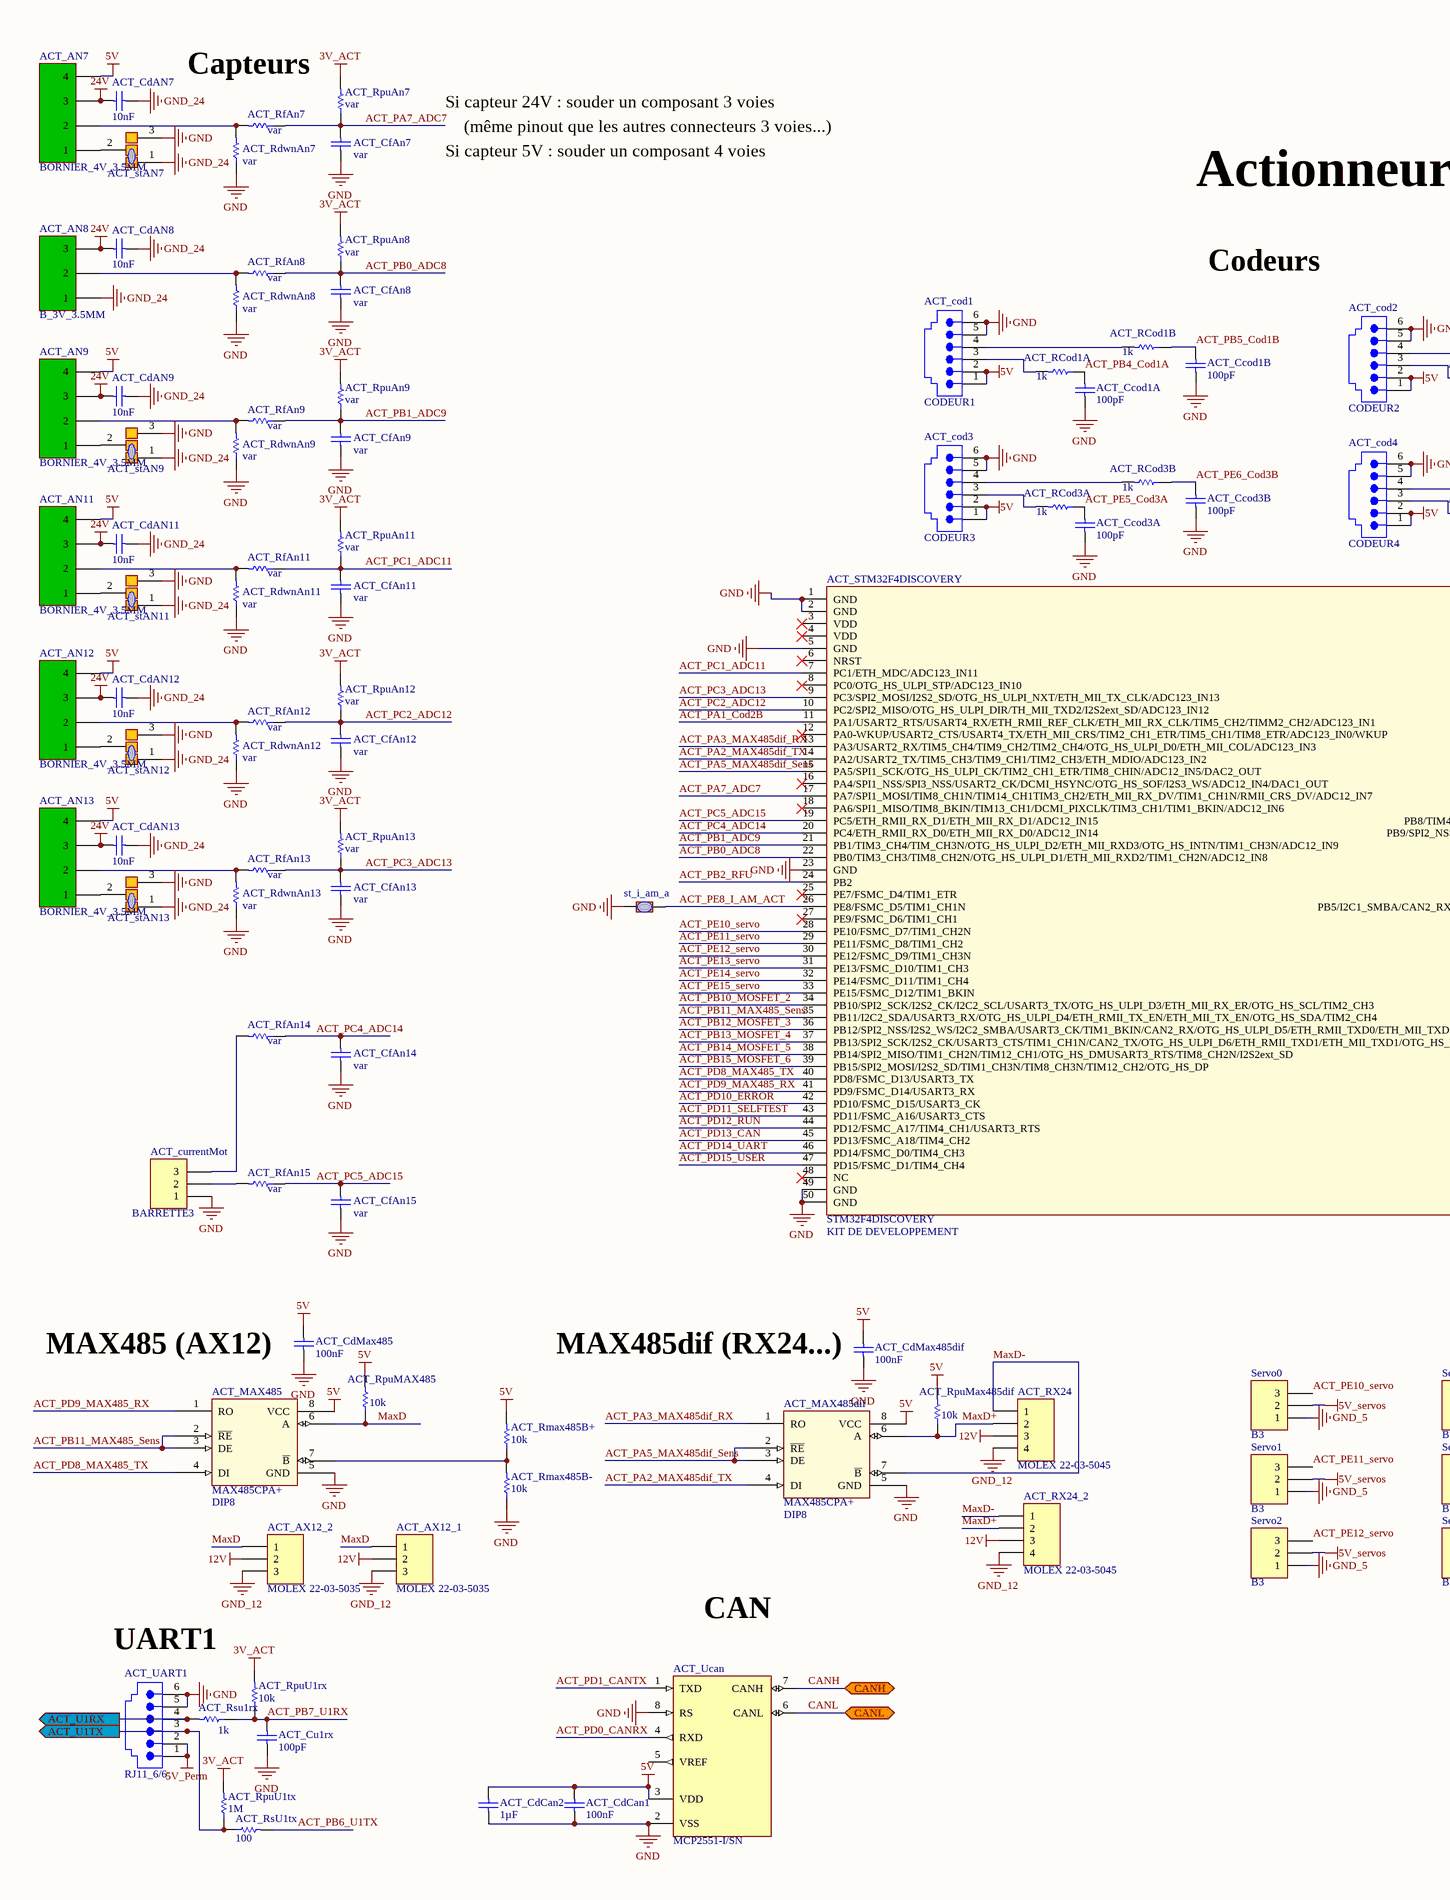
[diagram p3: 2018_FDP_ACTIONNEUR.SchDoc, left]
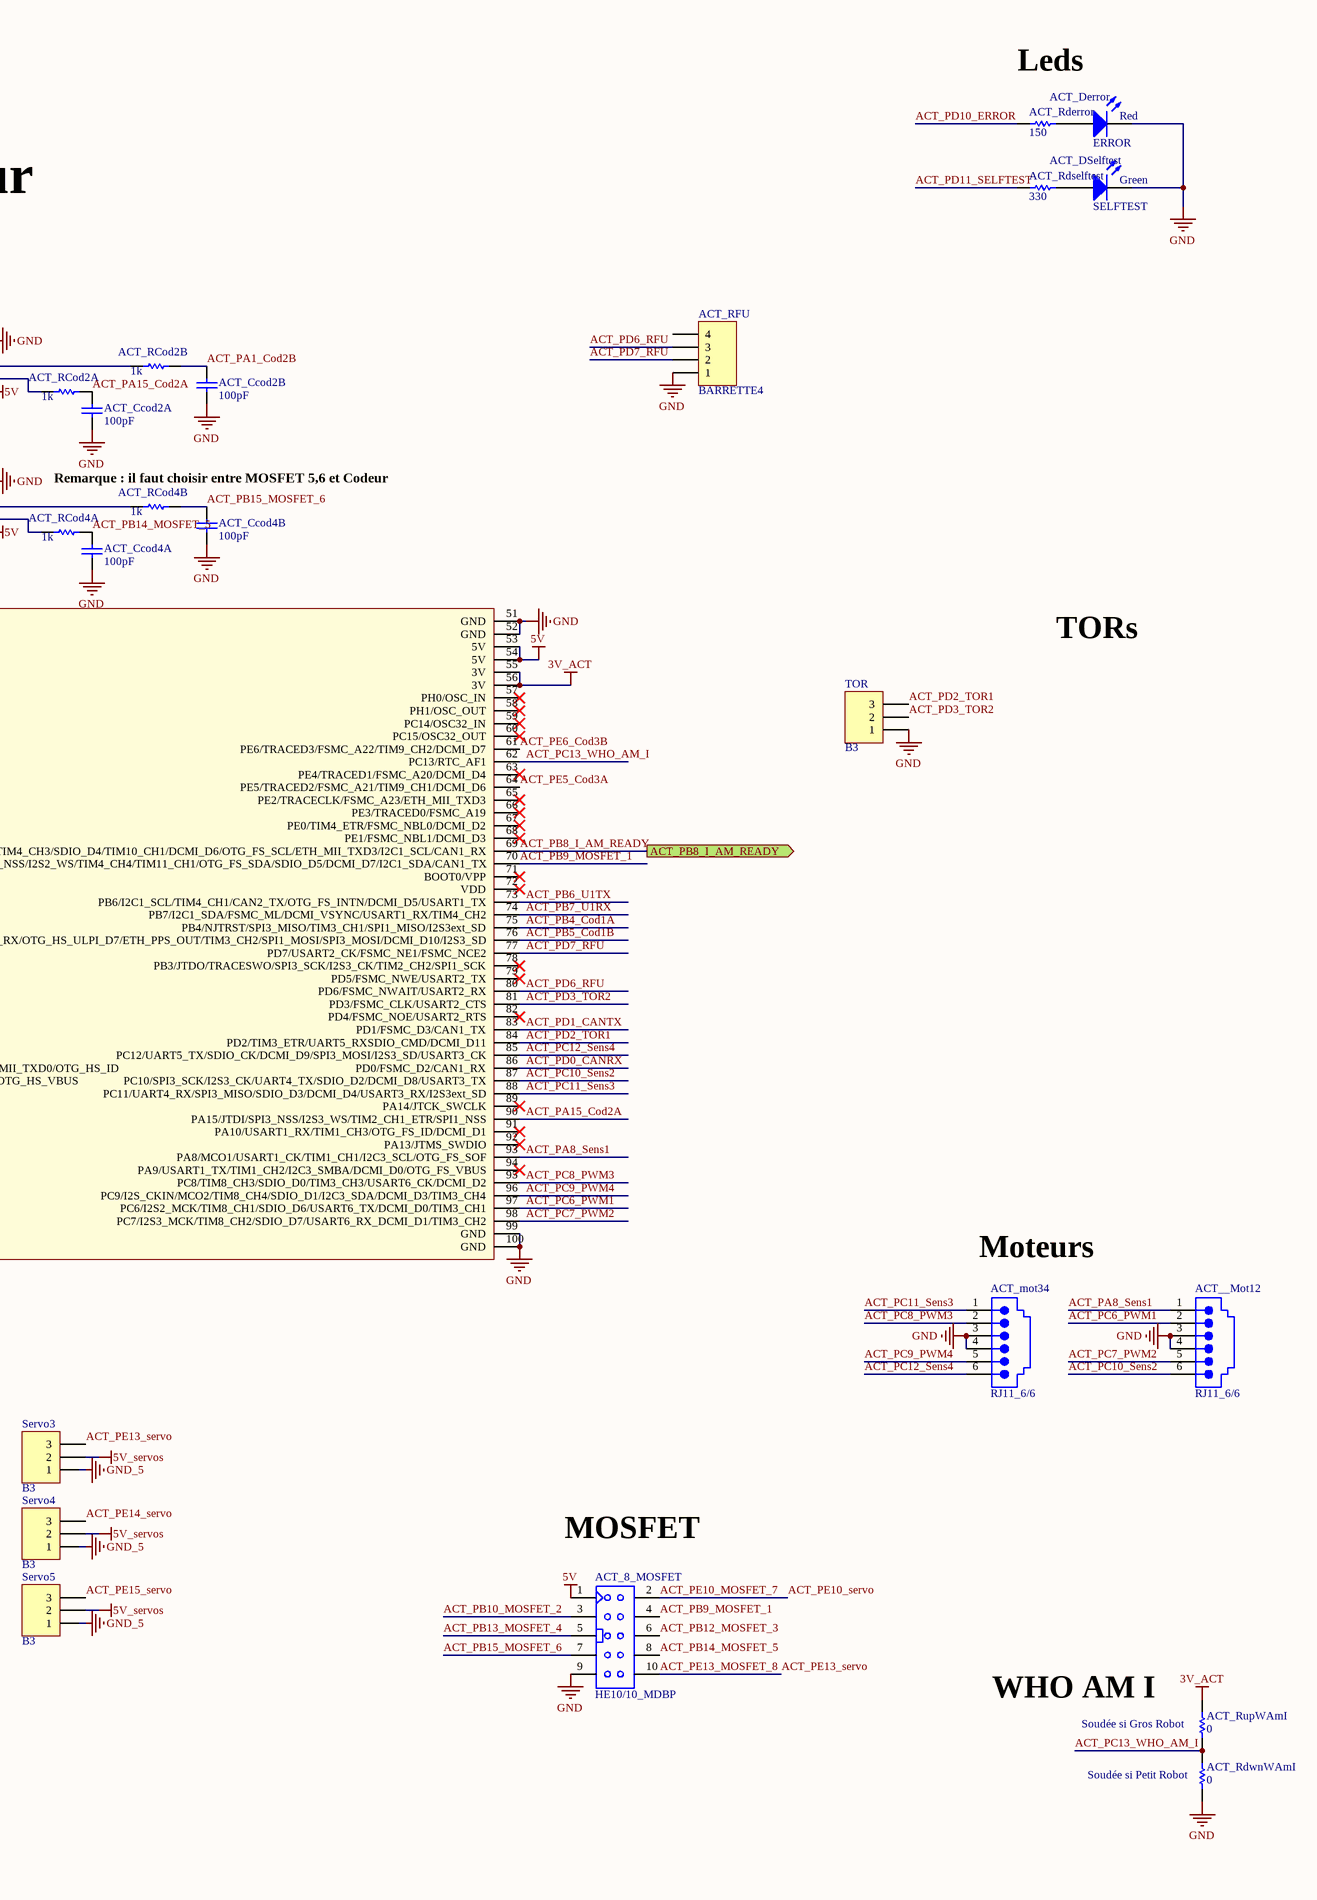
[diagram p4: 2018_FDP_ACTIONNEUR.SchDoc, right]

### Parts
ACT_8_MOSFET  Type: HE10/10_MDBP  [HE10/10_M_D_BP]  (hidden comment: HE10/10_MALE_DROIT_BAS_PROFIL)
ACT__Mot12  RJ11_6/6  [RJ11_6/6 - droit]
ACT_AN7  BORNIER_4V_3.5MM  [BORNIER_4V_3.5MM]
ACT_AN8  B_3V_3.5MM  [BORNIER_3V_3.5MM]
ACT_AN9  BORNIER_4V_3.5MM  [BORNIER_4V_3.5MM]
ACT_AN11  BORNIER_4V_3.5MM  [BORNIER_4V_3.5MM]
ACT_AN12  BORNIER_4V_3.5MM  [BORNIER_4V_3.5MM]
ACT_AN13  BORNIER_4V_3.5MM  [BORNIER_4V_3.5MM]
ACT_AX12_1  MOLEX 22-03-5035  [MOLEX3_2.5MM]
ACT_AX12_2  MOLEX 22-03-5035  [MOLEX3_2.5MM]
ACT_Ccod1A  100pF  [C0805_N]
ACT_Ccod1B  100pF  [C0805_N]
ACT_Ccod2A  100pF  [C0805_N]
ACT_Ccod2B  100pF  [C0805_N]
ACT_Ccod3A  100pF  [C0805_N]
ACT_Ccod3B  100pF  [C0805_N]
ACT_Ccod4A  100pF  [C0805_N]
ACT_Ccod4B  100pF  [C0805_N]
ACT_CdAN7  10nF  [C0805_N]
ACT_CdAN8  10nF  [C0805_N]
ACT_CdAN9  10nF  [C0805_N]
ACT_CdAN11  10nF  [C0805_N]
ACT_CdAN12  10nF  [C0805_N]
ACT_CdAN13  10nF  [C0805_N]
ACT_CdCan1  100nF  [C0805_N]
ACT_CdCan2  1µF  [C0805_N]
ACT_CdMax485  100nF  [C0805_N]
ACT_CdMax485dif  100nF  [C0805_N]
ACT_CfAn7  var  [C0805_N]
ACT_CfAn8  var  [C0805_N]
ACT_CfAn9  var  [C0805_N]
ACT_CfAn11  var  [C0805_N]
ACT_CfAn12  var  [C0805_N]
ACT_CfAn13  var  [C0805_N]
ACT_CfAn14  var  [C0805_N]
ACT_CfAn15  var  [C0805_N]
ACT_cod1  CODEUR1  [RJ11_6/6 - droit]
ACT_cod2  CODEUR2  [RJ11_6/6 - droit]
ACT_cod3  CODEUR3  [RJ11_6/6 - droit]
ACT_cod4  CODEUR4  [RJ11_6/6 - droit]
ACT_Cu1rx  100pF  [C0805_N]
ACT_currentMot  BARRETTE3  [HE14_3]
ACT_Derror  ERROR  [LED_0805]
ACT_DSelftest  SELFTEST  [LED_0805]
ACT_MAX485  Type: MAX485CPA+  Package: DIP8  [SO8_N]  (hidden comment: MAX485CPA+_DIP8)
ACT_MAX485dif  Type: MAX485CPA+  Package: DIP8  [SO8_N]  (hidden comment: MAX485CPA+_DIP8)
ACT_mot34  RJ11_6/6  [RJ11_6/6 - droit]
ACT_RCod1A  1k  [R1206_N]
ACT_RCod1B  1k  [R1206_N]
ACT_RCod2A  1k  [R1206_N]
ACT_RCod2B  1k  [R1206_N]
ACT_RCod3A  1k  [R1206_N]
ACT_RCod3B  1k  [R1206_N]
ACT_RCod4A  1k  [R1206_N]
ACT_RCod4B  1k  [R1206_N]
ACT_Rderror  150  [R1206_N]
ACT_Rdselftest  330  [R1206_N]
ACT_RdwnAn7  var  [R1206_N]
ACT_RdwnAn8  var  [R1206_N]
ACT_RdwnAn9  var  [R1206_N]
ACT_RdwnAn11  var  [R1206_N]
ACT_RdwnAn12  var  [R1206_N]
ACT_RdwnAn13  var  [R1206_N]
ACT_RdwnWAmI  0  [R1206_N]
ACT_RfAn7  var  [R1206_N]
ACT_RfAn8  var  [R1206_N]
ACT_RfAn9  var  [R1206_N]
ACT_RfAn11  var  [R1206_N]
ACT_RfAn12  var  [R1206_N]
ACT_RfAn13  var  [R1206_N]
ACT_RfAn14  var  [R1206_N]
ACT_RfAn15  var  [R1206_N]
ACT_RFU  BARRETTE4  [HE14_4]
ACT_Rmax485B+  10k  [R1206_N]
ACT_Rmax485B-  10k  [R1206_N]
ACT_RpuAn7  var  [R1206_N]
ACT_RpuAn8  var  [R1206_N]
ACT_RpuAn9  var  [R1206_N]
ACT_RpuAn11  var  [R1206_N]
ACT_RpuAn12  var  [R1206_N]
ACT_RpuAn13  var  [R1206_N]
ACT_RpuMAX485  10k  [R1206_N]
ACT_RpuMax485dif  10k  [R1206_N]
ACT_RpuU1rx  10k  [R1206_N]
ACT_RpuU1tx  1M  [R1206_N]
ACT_Rsu1rx  1k  [R1206_N]
ACT_RsU1tx  100  [R1206_N]
ACT_RupWAmI  0  [R1206_N]
ACT_RX24  MOLEX 22-03-5045  [MOLEX4_2.5MM]
ACT_RX24_2  MOLEX 22-03-5045  [MOLEX4_2.5MM]
ACT_stAN7  strap  [Goutte Strap_3]  (value not drawn)
ACT_stAN9  strap  [Goutte Strap_3]  (value not drawn)
ACT_stAN11  strap  [Goutte Strap_3]  (value not drawn)
ACT_stAN12  strap  [Goutte Strap_3]  (value not drawn)
ACT_stAN13  strap  [Goutte Strap_3]  (value not drawn)
ACT_STM32F4DISCOVERY  STM32F4DISCOVERY  Type: KIT DE DEVELOPPEMENT  [STM32_F4DISCOVERY]
ACT_UART1  RJ11_6/6  [RJ11_6/6 - droit]
ACT_Ucan  MCP2551-I/SN  [SO8_N]
Servo0  B3  [HE14_3]
Servo1  B3  [HE14_3]
Servo2  B3  [HE14_3]
Servo3  B3  [HE14_3]
Servo4  B3  [HE14_3]
Servo5  B3  [HE14_3]
st_i_am_a  Goutte Strap_2  [Goutte Strap_2 Pads_Clearance 0.254mm]  (value not drawn)
TOR  B3  [HE14_3]

### Ports
ACT_PB8_I_AM_READY (out), ACT_U1RX (out), ACT_U1TX (out), CANH (bidir), CANL (bidir)

### Nets
3V_ACT: ACT_RpuAn7.2 ACT_RpuAn8.2 ACT_RpuAn9.2 ACT_RpuAn11.2 ACT_RpuAn12.2 ACT_RpuAn13.2 ACT_RpuU1rx.2 ACT_RpuU1tx.2 ACT_RupWAmI.2 ACT_STM32F4DISCOVERY.55(3V) ACT_STM32F4DISCOVERY.56(3V)
5V: ACT_8_MOSFET.1 ACT_AN7.4 ACT_AN9.4 ACT_AN11.4 ACT_AN12.4 ACT_AN13.4 ACT_CdCan1.2 ACT_CdCan2.2 ACT_CdMax485.2 ACT_CdMax485dif.2 ACT_cod1.1 ACT_cod1.2 ACT_cod2.1 ACT_cod2.2 ACT_cod3.1 ACT_cod3.2 ACT_cod4.1 ACT_cod4.2 ACT_MAX485.8(VCC) ACT_MAX485dif.8(VCC) ACT_Rmax485B+.2 ACT_RpuMAX485.2 ACT_RpuMax485dif.2 ACT_STM32F4DISCOVERY.53(5V) ACT_STM32F4DISCOVERY.54(5V) ACT_Ucan.3(VDD)
5V_Perm: ACT_UART1.1 ACT_UART1.2
5V_servos: Servo0.2 Servo1.2 Servo2.2 Servo3.2 Servo4.2 Servo5.2
12V: ACT_AX12_1.2 ACT_AX12_2.2 ACT_RX24.3 ACT_RX24_2.3
24V: ACT_AN7.3 ACT_AN8.3 ACT_AN9.3 ACT_AN11.3 ACT_AN12.3 ACT_AN13.3 ACT_CdAN7.2 ACT_CdAN8.2 ACT_CdAN9.2 ACT_CdAN11.2 ACT_CdAN12.2 ACT_CdAN13.2
GND: ACT_8_MOSFET.9 ACT__Mot12.3 ACT__Mot12.4 ACT_Ccod1A.1 ACT_Ccod1B.1 ACT_Ccod2A.1 ACT_Ccod2B.1 ACT_Ccod3A.1 ACT_Ccod3B.1 ACT_Ccod4A.1 ACT_Ccod4B.1 ACT_CdCan1.1 ACT_CdCan2.1 ACT_CdMax485.1 ACT_CdMax485dif.1 ACT_CfAn7.1 ACT_CfAn8.1 ACT_CfAn9.1 ACT_CfAn11.1 ACT_CfAn12.1 ACT_CfAn13.1 ACT_CfAn14.1 ACT_CfAn15.1 ACT_cod1.5 ACT_cod1.6 ACT_cod2.5 ACT_cod2.6 ACT_cod3.5 ACT_cod3.6 ACT_cod4.5 ACT_cod4.6 ACT_Cu1rx.1 ACT_currentMot.1 ACT_Derror.2(K) ACT_DSelftest.2(K) ACT_MAX485.5(GND) ACT_MAX485dif.5(GND) ACT_mot34.3 ACT_mot34.4 ACT_RdwnAn7.1 ACT_RdwnAn8.1 ACT_RdwnAn9.1 ACT_RdwnAn11.1 ACT_RdwnAn12.1 ACT_RdwnAn13.1 ACT_RdwnWAmI.1 ACT_RFU.1 ACT_Rmax485B-.1 ACT_stAN7.3 ACT_stAN9.3 ACT_stAN11.3 ACT_stAN12.3 ACT_stAN13.3 ACT_STM32F4DISCOVERY.1(GND) ACT_STM32F4DISCOVERY.2(GND) ACT_STM32F4DISCOVERY.5(GND) ACT_STM32F4DISCOVERY.23(GND) ACT_STM32F4DISCOVERY.49(GND) ACT_STM32F4DISCOVERY.50(GND) ACT_STM32F4DISCOVERY.51(GND) ACT_STM32F4DISCOVERY.52(GND) ACT_STM32F4DISCOVERY.99(GND) ACT_STM32F4DISCOVERY.100(GND) ACT_UART1.5 ACT_UART1.6 ACT_Ucan.2(VSS) ACT_Ucan.8(RS) st_i_am_a.1 TOR.1
GND_5: Servo0.1 Servo1.1 Servo2.1 Servo3.1 Servo4.1 Servo5.1
GND_12: ACT_AX12_1.3 ACT_AX12_2.3 ACT_RX24.4 ACT_RX24_2.4
GND_24: ACT_AN8.1 ACT_CdAN7.1 ACT_CdAN8.1 ACT_CdAN9.1 ACT_CdAN11.1 ACT_CdAN12.1 ACT_CdAN13.1 ACT_stAN7.1 ACT_stAN9.1 ACT_stAN11.1 ACT_stAN12.1 ACT_stAN13.1
ACT_PA1_Cod2B: ACT_Ccod2B.2 ACT_RCod2B.1 ACT_STM32F4DISCOVERY.11(PA1/USART2_RTS/USART4_RX/ETH_RMII_REF_CLK/ETH_MII_RX_CLK/TIM5_CH2/TIMM2_CH2/ADC123_IN1)
ACT_PA2_MAX485dif_TX: ACT_MAX485dif.4(DI) ACT_STM32F4DISCOVERY.14(PA2/USART2_TX/TIM5_CH3/TIM9_CH1/TIM2_CH3/ETH_MDIO/ADC123_IN2)
ACT_PA3_MAX485dif_RX: ACT_MAX485dif.1(RO) ACT_STM32F4DISCOVERY.13(PA3/USART2_RX/TIM5_CH4/TIM9_CH2/TIM2_CH4/OTG_HS_ULPI_D0/ETH_MII_COL/ADC123_IN3)
ACT_PA5_MAX485dif_Sens: ACT_MAX485dif.2(~{RE}) ACT_MAX485dif.3(DE) ACT_STM32F4DISCOVERY.15(PA5/SPI1_SCK/OTG_HS_ULPI_CK/TIM2_CH1_ETR/TIM8_CHIN/ADC12_IN5/DAC2_OUT)
ACT_PA7_ADC7: ACT_CfAn7.2 ACT_RfAn7.1 ACT_RpuAn7.1 ACT_STM32F4DISCOVERY.17(PA7/SPI1_MOSI/TIM8_CH1N/TIM14_CH1TIM3_CH2/ETH_MII_RX_DV/TIM1_CH1N/RMII_CRS_DV/ADC12_IN7)
ACT_PA8_Sens1: ACT__Mot12.1 ACT_STM32F4DISCOVERY.93(PA8/MCO1/USART1_CK/TIM1_CH1/I2C3_SCL/OTG_FS_SOF)
ACT_PA15_Cod2A: ACT_Ccod2A.2 ACT_RCod2A.1 ACT_STM32F4DISCOVERY.90(PA15/JTDI/SPI3_NSS/I2S3_WS/TIM2_CH1_ETR/SPI1_NSS)
ACT_PB0_ADC8: ACT_CfAn8.2 ACT_RfAn8.1 ACT_RpuAn8.1 ACT_STM32F4DISCOVERY.22(PB0/TIM3_CH3/TIM8_CH2N/OTG_HS_ULPI_D1/ETH_MII_RXD2/TIM1_CH2N/ADC12_IN8)
ACT_PB1_ADC9: ACT_CfAn9.2 ACT_RfAn9.1 ACT_RpuAn9.1 ACT_STM32F4DISCOVERY.21(PB1/TIM3_CH4/TIM_CH3N/OTG_HS_ULPI_D2/ETH_MII_RXD3/OTG_HS_INTN/TIM1_CH3N/ADC12_IN9)
ACT_PB2_RFU: ACT_STM32F4DISCOVERY.24(PB2)
ACT_PB4_Cod1A: ACT_Ccod1A.2 ACT_RCod1A.1 ACT_STM32F4DISCOVERY.75(PB4/NJTRST/SPI3_MISO/TIM3_CH1/SPI1_MISO/I2S3ext_SD)
ACT_PB5_Cod1B: ACT_Ccod1B.2 ACT_RCod1B.1 ACT_STM32F4DISCOVERY.76(PB5/I2C1_SMBA/CAN2_RX/OTG_HS_ULPI_D7/ETH_PPS_OUT/TIM3_CH2/SPI1_MOSI/SPI3_MOSI/DCMI_D10/I2S3_SD)
ACT_PB6_U1TX: ACT_RsU1tx.2 ACT_STM32F4DISCOVERY.73(PB6/I2C1_SCL/TIM4_CH1/CAN2_TX/OTG_FS_INTN/DCMI_D5/USART1_TX)
ACT_PB7_U1RX: ACT_Cu1rx.2 ACT_RpuU1rx.1 ACT_Rsu1rx.1 ACT_STM32F4DISCOVERY.74(PB7/I2C1_SDA/FSMC_ML/DCMI_VSYNC/USART1_RX/TIM4_CH2)
ACT_PB8_I_AM_READY: ACT_STM32F4DISCOVERY.69(PB8/TIM4_CH3/SDIO_D4/TIM10_CH1/DCMI_D6/OTG_FS_SCL/ETH_MII_TXD3/I2C1_SCL/CAN1_RX) ; port ACT_PB8_I_AM_READY
ACT_PB9_MOSFET_1: ACT_8_MOSFET.4 ACT_STM32F4DISCOVERY.70(PB9/SPI2_NSS/I2S2_WS/TIM4_CH4/TIM11_CH1/OTG_FS_SDA/SDIO_D5/DCMI_D7/I2C1_SDA/CAN1_TX)
ACT_PB10_MOSFET_2: ACT_8_MOSFET.3 ACT_STM32F4DISCOVERY.34(PB10/SPI2_SCK/I2S2_CK/I2C2_SCL/USART3_TX/OTG_HS_ULPI_D3/ETH_MII_RX_ER/OTG_HS_SCL/TIM2_CH3)
ACT_PB11_MAX485_Sens: ACT_MAX485.2(~{RE}) ACT_MAX485.3(DE) ACT_STM32F4DISCOVERY.35(PB11/I2C2_SDA/USART3_RX/OTG_HS_ULPI_D4/ETH_RMII_TX_EN/ETH_MII_TX_EN/OTG_HS_SDA/TIM2_CH4)
ACT_PB12_MOSFET_3: ACT_8_MOSFET.6 ACT_STM32F4DISCOVERY.36(PB12/SPI2_NSS/I2S2_WS/I2C2_SMBA/USART3_CK/TIM1_BKIN/CAN2_RX/OTG_HS_ULPI_D5/ETH_RMII_TXD0/ETH_MII_TXD0/OTG_HS_ID)
ACT_PB13_MOSFET_4: ACT_8_MOSFET.5 ACT_STM32F4DISCOVERY.37(PB13/SPI2_SCK/I2S2_CK/USART3_CTS/TIM1_CH1N/CAN2_TX/OTG_HS_ULPI_D6/ETH_RMII_TXD1/ETH_MII_TXD1/OTG_HS_VBUS)
ACT_PB14_MOSFET_5: ACT_8_MOSFET.8 ACT_Ccod4A.2 ACT_RCod4A.1 ACT_STM32F4DISCOVERY.38(PB14/SPI2_MISO/TIM1_CH2N/TIM12_CH1/OTG_HS_DMUSART3_RTS/TIM8_CH2N/I2S2ext_SD)
ACT_PB15_MOSFET_6: ACT_8_MOSFET.7 ACT_Ccod4B.2 ACT_RCod4B.1 ACT_STM32F4DISCOVERY.39(PB15/SPI2_MOSI/I2S2_SD/TIM1_CH3N/TIM8_CH3N/TIM12_CH2/OTG_HS_DP)
ACT_PC1_ADC11: ACT_CfAn11.2 ACT_RfAn11.1 ACT_RpuAn11.1 ACT_STM32F4DISCOVERY.7(PC1/ETH_MDC/ADC123_IN11)
ACT_PC2_ADC12: ACT_CfAn12.2 ACT_RfAn12.1 ACT_RpuAn12.1 ACT_STM32F4DISCOVERY.10(PC2/SPI2_MISO/OTG_HS_ULPI_DIR/TH_MII_TXD2/I2S2ext_SD/ADC123_IN12)
ACT_PC3_ADC13: ACT_CfAn13.2 ACT_RfAn13.1 ACT_RpuAn13.1 ACT_STM32F4DISCOVERY.9(PC3/SPI2_MOSI/I2S2_SD/OTG_HS_ULPI_NXT/ETH_MII_TX_CLK/ADC123_IN13)
ACT_PC4_ADC14: ACT_CfAn14.2 ACT_RfAn14.1 ACT_STM32F4DISCOVERY.20(PC4/ETH_RMII_RX_D0/ETH_MII_RX_D0/ADC12_IN14)
ACT_PC5_ADC15: ACT_CfAn15.2 ACT_RfAn15.1 ACT_STM32F4DISCOVERY.19(PC5/ETH_RMII_RX_D1/ETH_MII_RX_D1/ADC12_IN15)
ACT_PC6_PWM1: ACT__Mot12.2 ACT_STM32F4DISCOVERY.97(PC6/I2S2_MCK/TIM8_CH1/SDIO_D6/USART6_TX/DCMI_D0/TIM3_CH1)
ACT_PC7_PWM2: ACT__Mot12.5 ACT_STM32F4DISCOVERY.98(PC7/I2S3_MCK/TIM8_CH2/SDIO_D7/USART6_RX_DCMI_D1/TIM3_CH2)
ACT_PC8_PWM3: ACT_mot34.2 ACT_STM32F4DISCOVERY.95(PC8/TIM8_CH3/SDIO_D0/TIM3_CH3/USART6_CK/DCMI_D2)
ACT_PC9_PWM4: ACT_mot34.5 ACT_STM32F4DISCOVERY.96(PC9/I2S_CKIN/MCO2/TIM8_CH4/SDIO_D1/I2C3_SDA/DCMI_D3/TIM3_CH4)
ACT_PC10_Sens2: ACT__Mot12.6 ACT_STM32F4DISCOVERY.87(PC10/SPI3_SCK/I2S3_CK/UART4_TX/SDIO_D2/DCMI_D8/USART3_TX)
ACT_PC11_Sens3: ACT_mot34.1 ACT_STM32F4DISCOVERY.88(PC11/UART4_RX/SPI3_MISO/SDIO_D3/DCMI_D4/USART3_RX/I2S3ext_SD)
ACT_PC12_Sens4: ACT_mot34.6 ACT_STM32F4DISCOVERY.85(PC12/UART5_TX/SDIO_CK/DCMI_D9/SPI3_MOSI/I2S3_SD/USART3_CK)
ACT_PC13_WHO_AM_I: ACT_RdwnWAmI.2 ACT_RupWAmI.1 ACT_STM32F4DISCOVERY.62(PC13/RTC_AF1)
ACT_PD0_CANRX: ACT_STM32F4DISCOVERY.86(PD0/FSMC_D2/CAN1_RX) ACT_Ucan.4(RXD)
ACT_PD1_CANTX: ACT_STM32F4DISCOVERY.83(PD1/FSMC_D3/CAN1_TX) ACT_Ucan.1(TXD)
ACT_PD2_TOR1: ACT_STM32F4DISCOVERY.84(PD2/TIM3_ETR/UART5_RXSDIO_CMD/DCMI_D11) TOR.3
ACT_PD3_TOR2: ACT_STM32F4DISCOVERY.81(PD3/FSMC_CLK/USART2_CTS) TOR.2
ACT_PD6_RFU: ACT_RFU.3 ACT_STM32F4DISCOVERY.80(PD6/FSMC_NWAIT/USART2_RX)
ACT_PD7_RFU: ACT_RFU.2 ACT_STM32F4DISCOVERY.77(PD7/USART2_CK/FSMC_NE1/FSMC_NCE2)
ACT_PD8_MAX485_TX: ACT_MAX485.4(DI) ACT_STM32F4DISCOVERY.40(PD8/FSMC_D13/USART3_TX)
ACT_PD9_MAX485_RX: ACT_MAX485.1(RO) ACT_STM32F4DISCOVERY.41(PD9/FSMC_D14/USART3_RX)
ACT_PD10_ERROR: ACT_Rderror.1 ACT_STM32F4DISCOVERY.42(PD10/FSMC_D15/USART3_CK)
ACT_PD11_SELFTEST: ACT_Rdselftest.1 ACT_STM32F4DISCOVERY.43(PD11/FSMC_A16/USART3_CTS)
ACT_PD12_RUN: ACT_STM32F4DISCOVERY.44(PD12/FSMC_A17/TIM4_CH1/USART3_RTS)
ACT_PD13_CAN: ACT_STM32F4DISCOVERY.45(PD13/FSMC_A18/TIM4_CH2)
ACT_PD14_UART: ACT_STM32F4DISCOVERY.46(PD14/FSMC_D0/TIM4_CH3)
ACT_PD15_USER: ACT_STM32F4DISCOVERY.47(PD15/FSMC_D1/TIM4_CH4)
ACT_PE5_Cod3A: ACT_Ccod3A.2 ACT_RCod3A.1 ACT_STM32F4DISCOVERY.64(PE5/TRACED2/FSMC_A21/TIM9_CH1/DCMI_D6)
ACT_PE6_Cod3B: ACT_Ccod3B.2 ACT_RCod3B.1 ACT_STM32F4DISCOVERY.61(PE6/TRACED3/FSMC_A22/TIM9_CH2/DCMI_D7)
ACT_PE8_I_AM_ACT: ACT_STM32F4DISCOVERY.26(PE8/FSMC_D5/TIM1_CH1N) st_i_am_a.2
ACT_PE10_MOSFET_7: ACT_8_MOSFET.2 ACT_STM32F4DISCOVERY.28(PE10/FSMC_D7/TIM1_CH2N) Servo0.3  [also labelled ACT_PE10_servo]
ACT_PE11_servo: ACT_STM32F4DISCOVERY.29(PE11/FSMC_D8/TIM1_CH2) Servo1.3
ACT_PE12_servo: ACT_STM32F4DISCOVERY.30(PE12/FSMC_D9/TIM1_CH3N) Servo2.3
ACT_PE13_MOSFET_8: ACT_8_MOSFET.10 ACT_STM32F4DISCOVERY.31(PE13/FSMC_D10/TIM1_CH3) Servo3.3  [also labelled ACT_PE13_servo]
ACT_PE14_servo: ACT_STM32F4DISCOVERY.32(PE14/FSMC_D11/TIM1_CH4) Servo4.3
ACT_PE15_servo: ACT_STM32F4DISCOVERY.33(PE15/FSMC_D12/TIM1_BKIN) Servo5.3
ACT_U1RX: ACT_Rsu1rx.2 ACT_UART1.4 ; port ACT_U1RX
ACT_U1TX: ACT_RpuU1tx.1 ACT_RsU1tx.1 ACT_UART1.3 ; port ACT_U1TX
CANH: ACT_Ucan.7(CANH) ; port CANH
CANL: ACT_Ucan.6(CANL) ; port CANL
MaxD: ACT_AX12_1.1 ACT_AX12_2.1 ACT_MAX485.6(A) ACT_RpuMAX485.1
MaxD+: ACT_MAX485dif.6(A) ACT_RpuMax485dif.1 ACT_RX24.2 ACT_RX24_2.2
MaxD-: ACT_MAX485dif.7(~{B}) ACT_RX24.1 ACT_RX24_2.1
NetACT_AN7_1: ACT_AN7.1 ACT_stAN7.2
NetACT_AN7_2: ACT_AN7.2 ACT_RdwnAn7.2 ACT_RfAn7.2
NetACT_AN8_2: ACT_AN8.2 ACT_RdwnAn8.2 ACT_RfAn8.2
NetACT_AN9_1: ACT_AN9.1 ACT_stAN9.2
NetACT_AN9_2: ACT_AN9.2 ACT_RdwnAn9.2 ACT_RfAn9.2
NetACT_AN11_1: ACT_AN11.1 ACT_stAN11.2
NetACT_AN11_2: ACT_AN11.2 ACT_RdwnAn11.2 ACT_RfAn11.2
NetACT_AN12_1: ACT_AN12.1 ACT_stAN12.2
NetACT_AN12_2: ACT_AN12.2 ACT_RdwnAn12.2 ACT_RfAn12.2
NetACT_AN13_1: ACT_AN13.1 ACT_stAN13.2
NetACT_AN13_2: ACT_AN13.2 ACT_RdwnAn13.2 ACT_RfAn13.2
NetACT_cod1_3: ACT_cod1.3 ACT_RCod1A.2
NetACT_cod1_4: ACT_cod1.4 ACT_RCod1B.2
NetACT_cod2_3: ACT_cod2.3 ACT_RCod2A.2
NetACT_cod2_4: ACT_cod2.4 ACT_RCod2B.2
NetACT_cod3_3: ACT_cod3.3 ACT_RCod3A.2
NetACT_cod3_4: ACT_cod3.4 ACT_RCod3B.2
NetACT_cod4_3: ACT_cod4.3 ACT_RCod4A.2
NetACT_cod4_4: ACT_cod4.4 ACT_RCod4B.2
NetACT_currentMot_2: ACT_currentMot.2 ACT_RfAn15.2
NetACT_currentMot_3: ACT_currentMot.3 ACT_RfAn14.2
NetACT_Derror_1: ACT_Derror.1(A) ACT_Rderror.2
NetACT_DSelftest_1: ACT_DSelftest.1(A) ACT_Rdselftest.2
NetACT_MAX485_7: ACT_MAX485.7(~{B}) ACT_Rmax485B+.1 ACT_Rmax485B-.2

Not connected (* = marked no-connect by the designer): ACT_RFU 4; ACT_STM32F4DISCOVERY 3(VDD)* 4(VDD)* 6(NRST)* 8(PC0/OTG_HS_ULPI_STP/ADC123_IN10)* 12(PA0-WKUP/USART2_CTS/USART4_TX/ETH_MII_CRS/TIM2_CH1_ETR/TIM5_CH1/TIM8_ETR/ADC123_IN0/WKUP)* 16(PA4/SPI1_NSS/SPI3_NSS/USART2_CK/DCMI_HSYNC/OTG_HS_SOF/I2S3_WS/ADC12_IN4/DAC1_OUT)* 18(PA6/SPI1_MISO/TIM8_BKIN/TIM13_CH1/DCMI_PIXCLK/TIM3_CH1/TIM1_BKIN/ADC12_IN6)* 25(PE7/FSMC_D4/TIM1_ETR)* 27(PE9/FSMC_D6/TIM1_CH1)* 48(NC)* 57(PH0/OSC_IN)* 58(PH1/OSC_OUT)* 59(PC14/OSC32_IN)* 60(PC15/OSC32_OUT)* 63(PE4/TRACED1/FSMC_A20/DCMI_D4)* 65(PE2/TRACECLK/FSMC_A23/ETH_MII_TXD3)* 66(PE3/TRACED0/FSMC_A19)* 67(PE0/TIM4_ETR/FSMC_NBL0/DCMI_D2)* 68(PE1/FSMC_NBL1/DCMI_D3)* 71(BOOT0/VPP)* 72(VDD)* 78(PB3/JTDO/TRACESWO/SPI3_SCK/I2S3_CK/TIM2_CH2/SPI1_SCK)* 79(PD5/FSMC_NWE/USART2_TX)* 82(PD4/FSMC_NOE/USART2_RTS)* 89(PA14/JTCK_SWCLK)* 91(PA10/USART1_RX/TIM1_CH3/OTG_FS_ID/DCMI_D1)* 92(PA13/JTMS_SWDIO)* 94(PA9/USART1_TX/TIM1_CH2/I2C3_SMBA/DCMI_D0/OTG_FS_VBUS)*; ACT_Ucan 5(VREF)

### Notes on the sheet
- Capteurs
- Si capteur 24V : souder un composant 3 voies
- Leds
- (near ACT_Derror) Red
- Si capteur 5V : souder un composant 4 voies
- (même pinout que les autres connecteurs 3 voies...)
- Actionneur
- (near ACT_DSelftest) Green
- Codeurs
- Remarque : il faut choisir entre MOSFET 5,6 et Codeur
- TORs
- (near ACT_mot34) Moteurs
- MAX485 (AX12)
- (near ACT_CdMax485dif) MAX485dif (RX24...)
- MOSFET
- CAN
- WHO AM I
- (near ACT_UART1) UART1
- (near ACT_RupWAmI) Soudée si Gros Robot
- (near ACT_RdwnWAmI) Soudée si Petit Robot
- Title
- Size:
- Date:
- File:
- A2
- Number:
- Time:
- Revision:
- Sheet
- of

### Library data of the parts
ACT_8_MOSFET = HE10/10_MALE_DROIT_BAS_PROFIL: EMBASE HE10/10 MALE DROIT BAS PROFIL
ACT__Mot12 ACT_cod1-ACT_cod4 ACT_mot34 ACT_UART1 = RJ11_6/6: as PRO_codDroite on sheet 2018_FDP_PROPULSION; Published: 25-Jun-2002; DatasheetDocument: 18-Dec-2001; PackageDocument: 18-Dec-2001; PackageReference: 15-43-6110; Publisher: Altium Limited; ComponentLink1Description: Manufacturer Link; ComponentLink1URL: http://www.molex.com/; ComponentLink2Description: Datasheet; ComponentLink2URL: http://www.molex.com/cmc_upload/common_files/1212003_41369catalogpage.pdf
  ACT__Mot12 ACT_mot34 ACT_UART1: Type: RJ11_6/6
ACT_AN8 = BORNIER_3V_3.5MM
ACT_AX12_1 ACT_AX12_2 ACT_currentMot Servo0-Servo5 TOR = BARRETTE3: Header, 3-Pin; LatestRevisionDate: 17-Jul-2002; LatestRevisionNote: Re-released for DXP Platform.; Publisher: Altium Limited
ACT_Ccod1A ACT_Ccod1B ACT_Ccod2A ACT_Ccod2B ACT_Ccod3A ACT_Ccod3B ACT_Ccod4A ACT_Ccod4B ACT_CdAN7-ACT_CdAN9 ACT_CdAN11-ACT_CdAN13 ACT_CdCan1 ACT_CdCan2 ACT_CdMax485 ACT_CdMax485dif ACT_CfAn7-ACT_CfAn9 ACT_CfAn11-ACT_CfAn15 ACT_Cu1rx = Condensateur: Capacitor; Published: 8-Jun-2000; LatestRevisionDate: 17-Jul-2002; LatestRevisionNote: Re-released for DXP Platform.; PackageReference: RAD-0.3; Publisher: Altium Limited
ACT_Derror ACT_DSelftest = LED: Typical LED; Published: 8-Jun-2000; LatestRevisionDate: 08-Jul-2005; LatestRevisionNote: Mech Layer 1 removed.; PackageReference: LED-1; Publisher: Altium Limited
ACT_MAX485 ACT_MAX485dif = MAX485CPA+_DIP8: EMETTEUR/RECEPTEUR FAIBLE PUISSANCE DE LIAISONS RS422/RS485 - DIP8
ACT_RCod1A ACT_RCod1B ACT_RCod2A ACT_RCod2B ACT_RCod3A ACT_RCod3B ACT_RCod4A ACT_RCod4B ACT_Rderror ACT_Rdselftest ACT_RdwnAn7-ACT_RdwnAn9 ACT_RdwnAn11-ACT_RdwnAn13 ACT_RdwnWAmI ACT_RfAn7-ACT_RfAn9 ACT_RfAn11-ACT_RfAn15 ACT_Rmax485B+ ACT_Rmax485B- ACT_RpuAn7-ACT_RpuAn9 ACT_RpuAn11-ACT_RpuAn13 ACT_RpuMAX485 ACT_RpuMax485dif ACT_RpuU1rx ACT_RpuU1tx ACT_Rsu1rx ACT_RsU1tx ACT_RupWAmI = Resistor: Published: 8-Jun-2000; LatestRevisionDate: 17-Jul-2002; LatestRevisionNote: Re-released for DXP Platform.; PackageReference: AXIAL-0.5; Publisher: Altium Limited
ACT_RFU ACT_RX24 ACT_RX24_2 = BARRETTE4: Header, 4-Pin; LatestRevisionDate: 17-Jul-2002; LatestRevisionNote: Re-released for DXP Platform.; Publisher: Altium Limited
ACT_stAN7 ACT_stAN9 ACT_stAN11-ACT_stAN13 = Goutte Strap_3: LatestRevisionDate: 25/11/09; Publisher: Damien Guitton
ACT_STM32F4DISCOVERY = STM32F4DISCOVERY: as PRO_STM32F4DISCOVERY on sheet 2018_FDP_PROPULSION
ACT_Ucan = MCP2551-I/SN: as PRO_Ucan on sheet 2018_FDP_PROPULSION; Published: 25/11/09; DatasheetVersion: revE, Jan-2007; PackageVersion: revAW, Oct-2008; PackageReference: SOIC-SN8; Publisher: Damien Guitton; PackageDescription: 8-Lead Plastic Small Outline (SN) - Narrow, 3.90mm Body [SOIC]; Code_JEDEC: MS-012; Code_IPC: SOIC127P600-8; ComponentLink1Description: Manufacturer Link; ComponentLink1URL: http://www.microchip.com; ComponentLink2Description: Datasheet; ComponentLink2URL: http://ww1.microchip.com/downloads/en/DeviceDoc/21667E.pdf; ComponentLink3Description: Packaging Specification; ComponentLink3URL: http://ww1.microchip.com/downloads/en/PackagingSpec/00049AW.pdf
st_i_am_a = Goutte Strap_2: LatestRevisionDate: 30/01/11; Publisher: Damien Guitton

## Nets that join several sheets
5V: 2018_FDP_SCHEMA (Alim.5 Cd_5V.2 D_BTtx.2 Dtransil.2), 2018_FDP_PROPULSION (12 pins), 2018_FDP_ACTIONNEUR (26 pins)
5V_Perm: 2018_FDP_SCHEMA (5 pins), 2018_FDP_PROPULSION (PRO_UART1.1 PRO_UART1.2), 2018_FDP_ACTIONNEUR (ACT_UART1.1 ACT_UART1.2)
5V_servos: 2018_FDP_SCHEMA (5V_servos.2), 2018_FDP_ACTIONNEUR (6 pins)
12V: 2018_FDP_SCHEMA (12V.2), 2018_FDP_ACTIONNEUR (ACT_AX12_1.2 ACT_AX12_2.2 ACT_RX24.3 ACT_RX24_2.3)
24V: 2018_FDP_SCHEMA (Alim.2), 2018_FDP_PROPULSION (12 pins), 2018_FDP_ACTIONNEUR (12 pins)
GND: 2018_FDP_SCHEMA (35 pins), 2018_FDP_PROPULSION (48 pins), 2018_FDP_ACTIONNEUR (69 pins)
GND_5: 2018_FDP_SCHEMA (5V_servos.1), 2018_FDP_ACTIONNEUR (6 pins)
GND_12: 2018_FDP_SCHEMA (12V.1), 2018_FDP_ACTIONNEUR (ACT_AX12_1.3 ACT_AX12_2.3 ACT_RX24.4 ACT_RX24_2.4)
GND_24: 2018_FDP_SCHEMA (Alim.1), 2018_FDP_PROPULSION (9 pins), 2018_FDP_ACTIONNEUR (12 pins)
ACT_PB8_I_AM_READY: 2018_FDP_SCHEMA (STR_RactRdy.2), 2018_FDP_ACTIONNEUR (ACT_STM32F4DISCOVERY.69)
ACT_U1RX: 2018_FDP_SCHEMA (ACT_JPr.2), 2018_FDP_ACTIONNEUR (ACT_Rsu1rx.2 ACT_UART1.4)
ACT_U1TX: 2018_FDP_SCHEMA (ACT_JPt.2), 2018_FDP_ACTIONNEUR (ACT_RpuU1tx.1 ACT_RsU1tx.1 ACT_UART1.3)
CANH: 2018_FDP_SCHEMA (5 pins), 2018_FDP_PROPULSION (PRO_Ucan.7), 2018_FDP_ACTIONNEUR (ACT_Ucan.7)
CANL: 2018_FDP_SCHEMA (5 pins), 2018_FDP_PROPULSION (PRO_Ucan.6), 2018_FDP_ACTIONNEUR (ACT_Ucan.6)
PRO_PB8_I_AM_READY: 2018_FDP_SCHEMA (STR_RproRdy.2), 2018_FDP_PROPULSION (PRO_STM32F4DISCOVERY.69)
PRO_U1RX: 2018_FDP_SCHEMA (PRO_JPr.2), 2018_FDP_PROPULSION (PRO_Rsu1rx.2 PRO_UART1.4)
PRO_U1TX: 2018_FDP_SCHEMA (PRO_JPt.2), 2018_FDP_PROPULSION (PRO_RpuU1tx.1 PRO_RsU1tx.1 PRO_UART1.3)